# EAGLE schematic 64CharTestDisp (EAGLE 9.4.2)
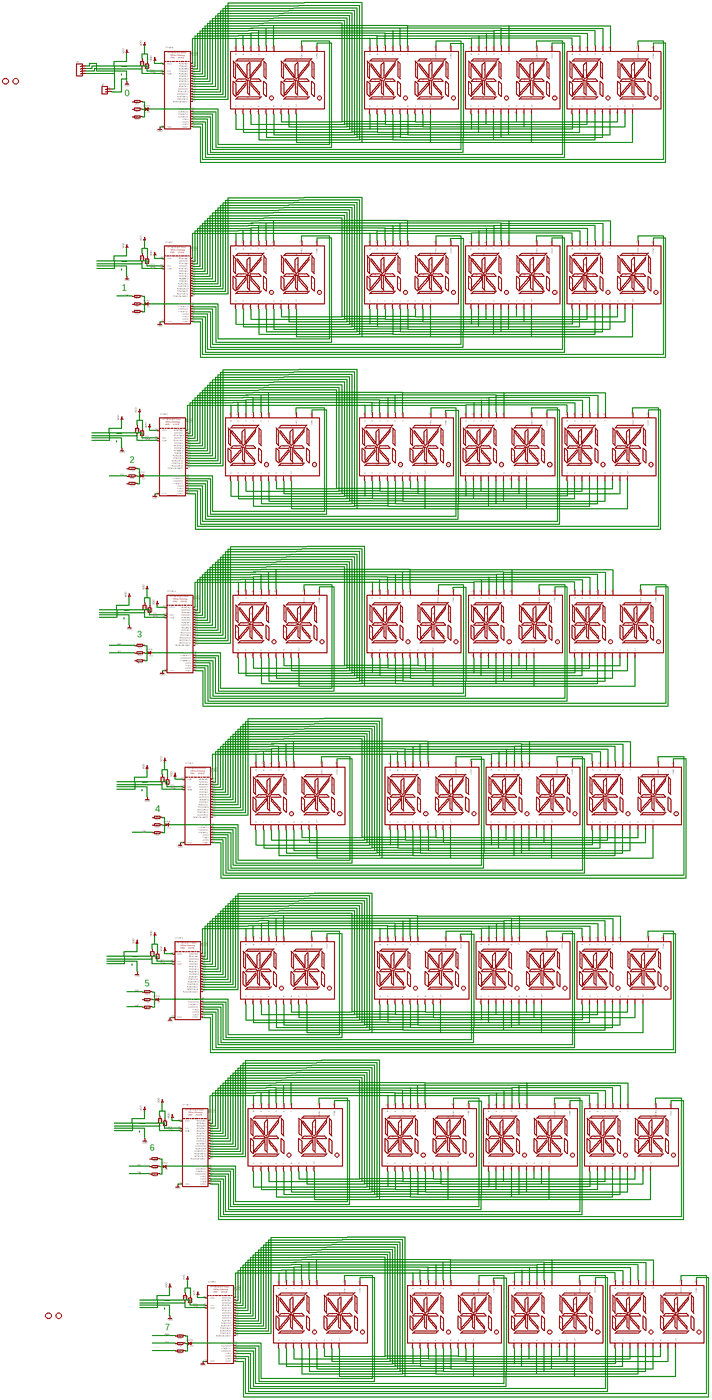
[diagram p0: schematic, sheet 1, overview]
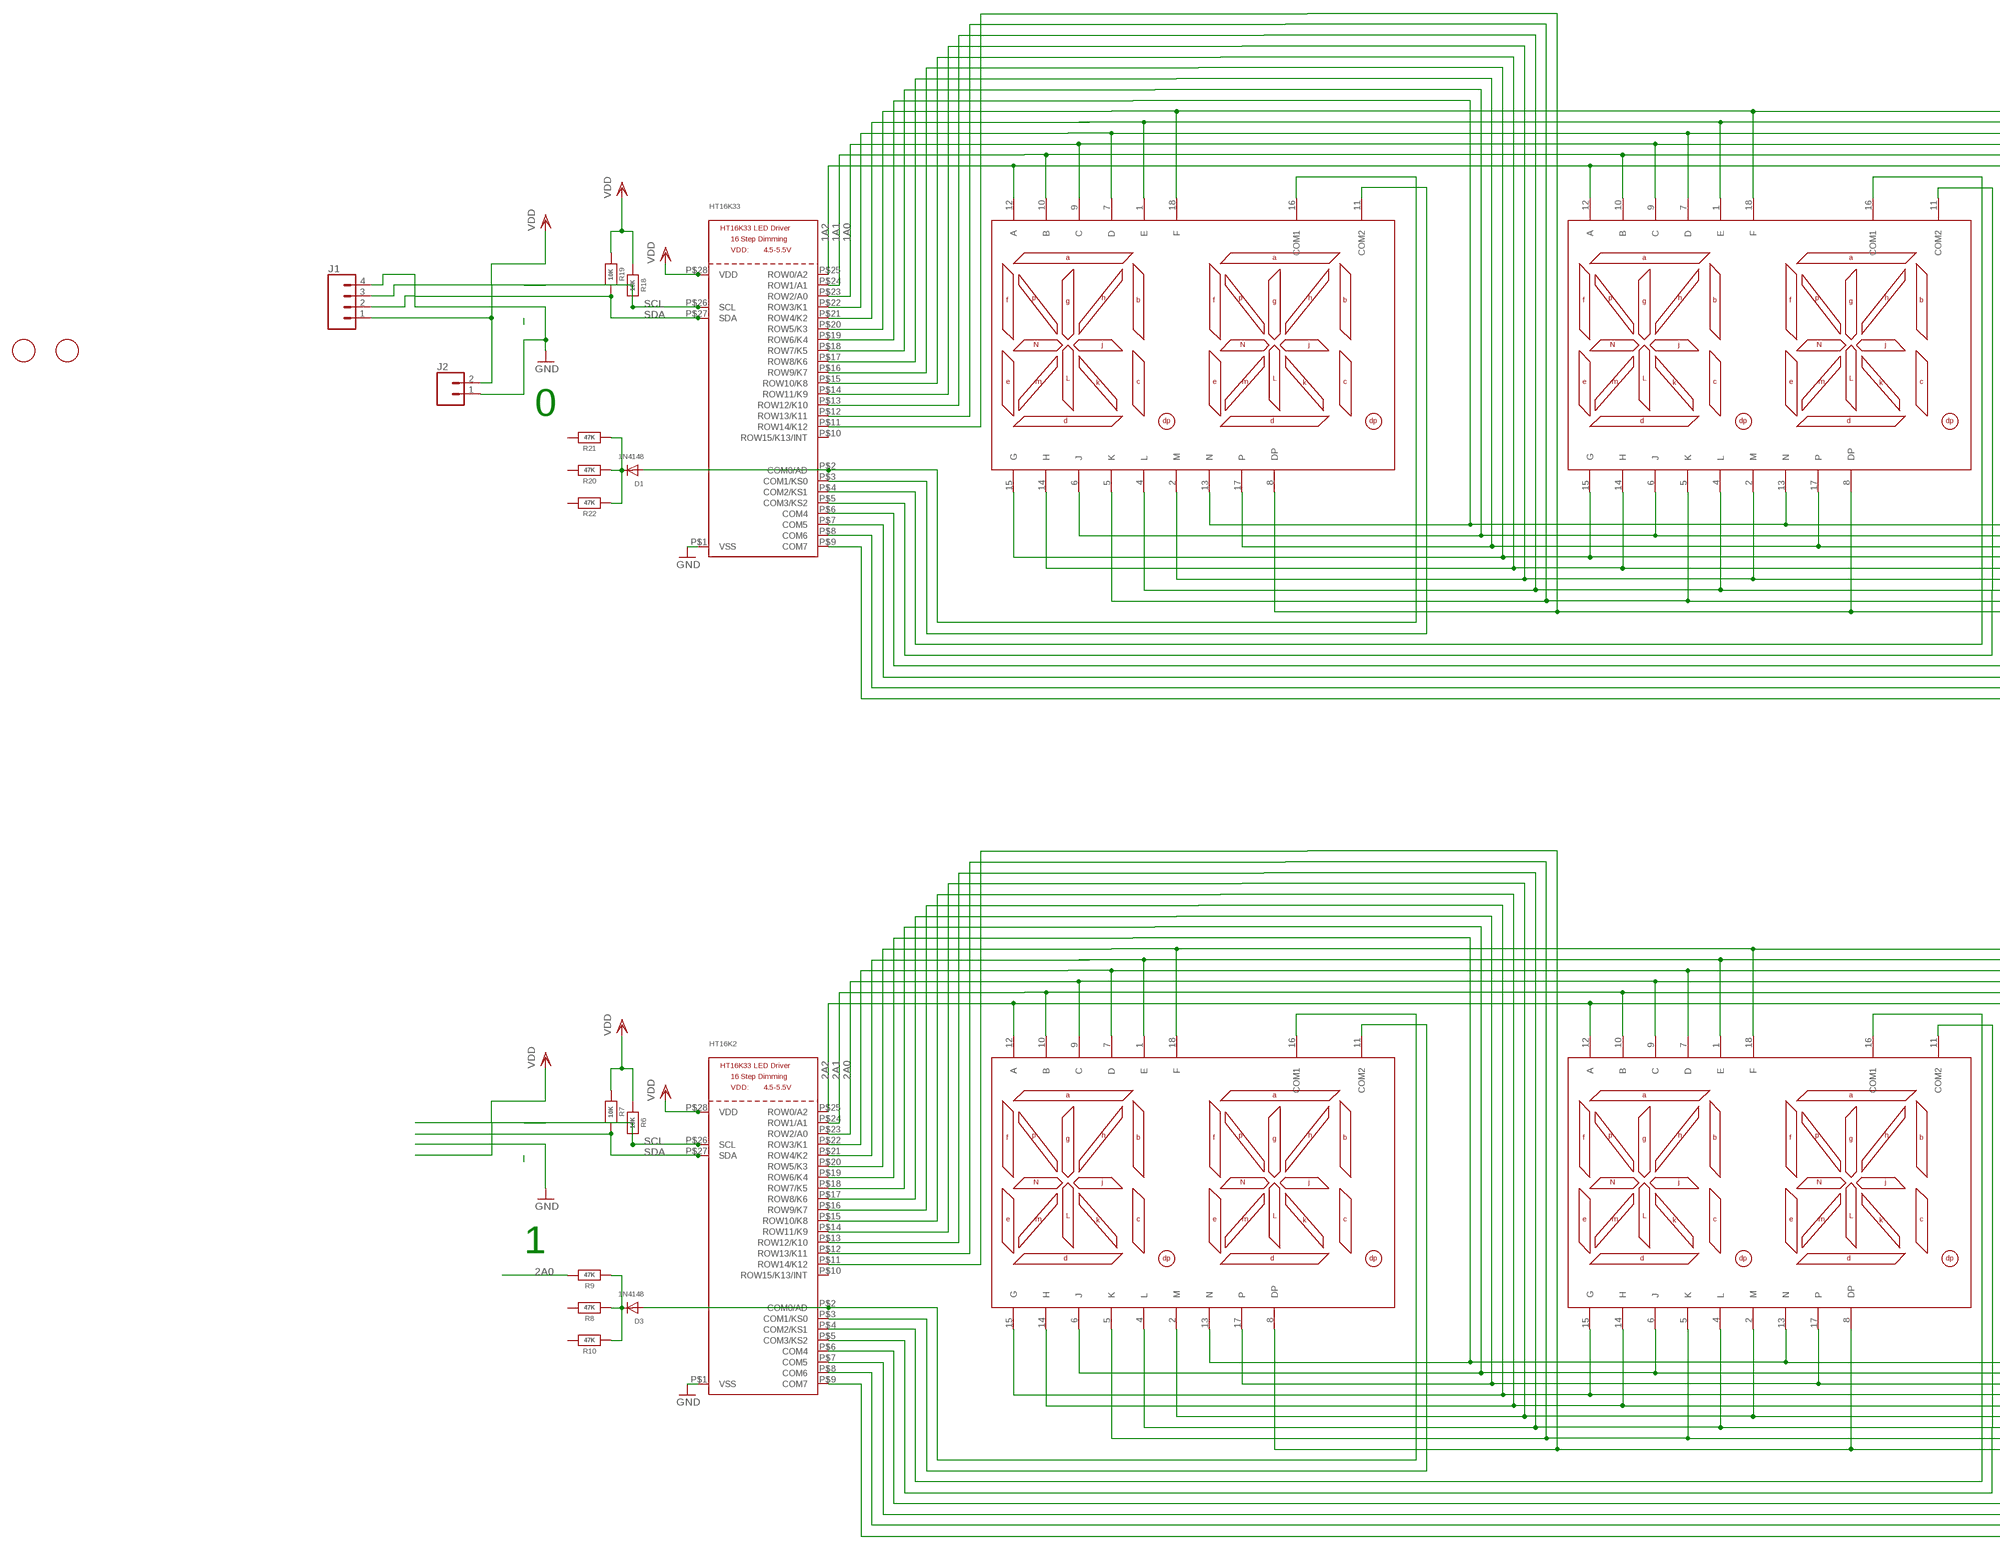
[diagram p1: schematic, sheet 1, part 1 of 8]
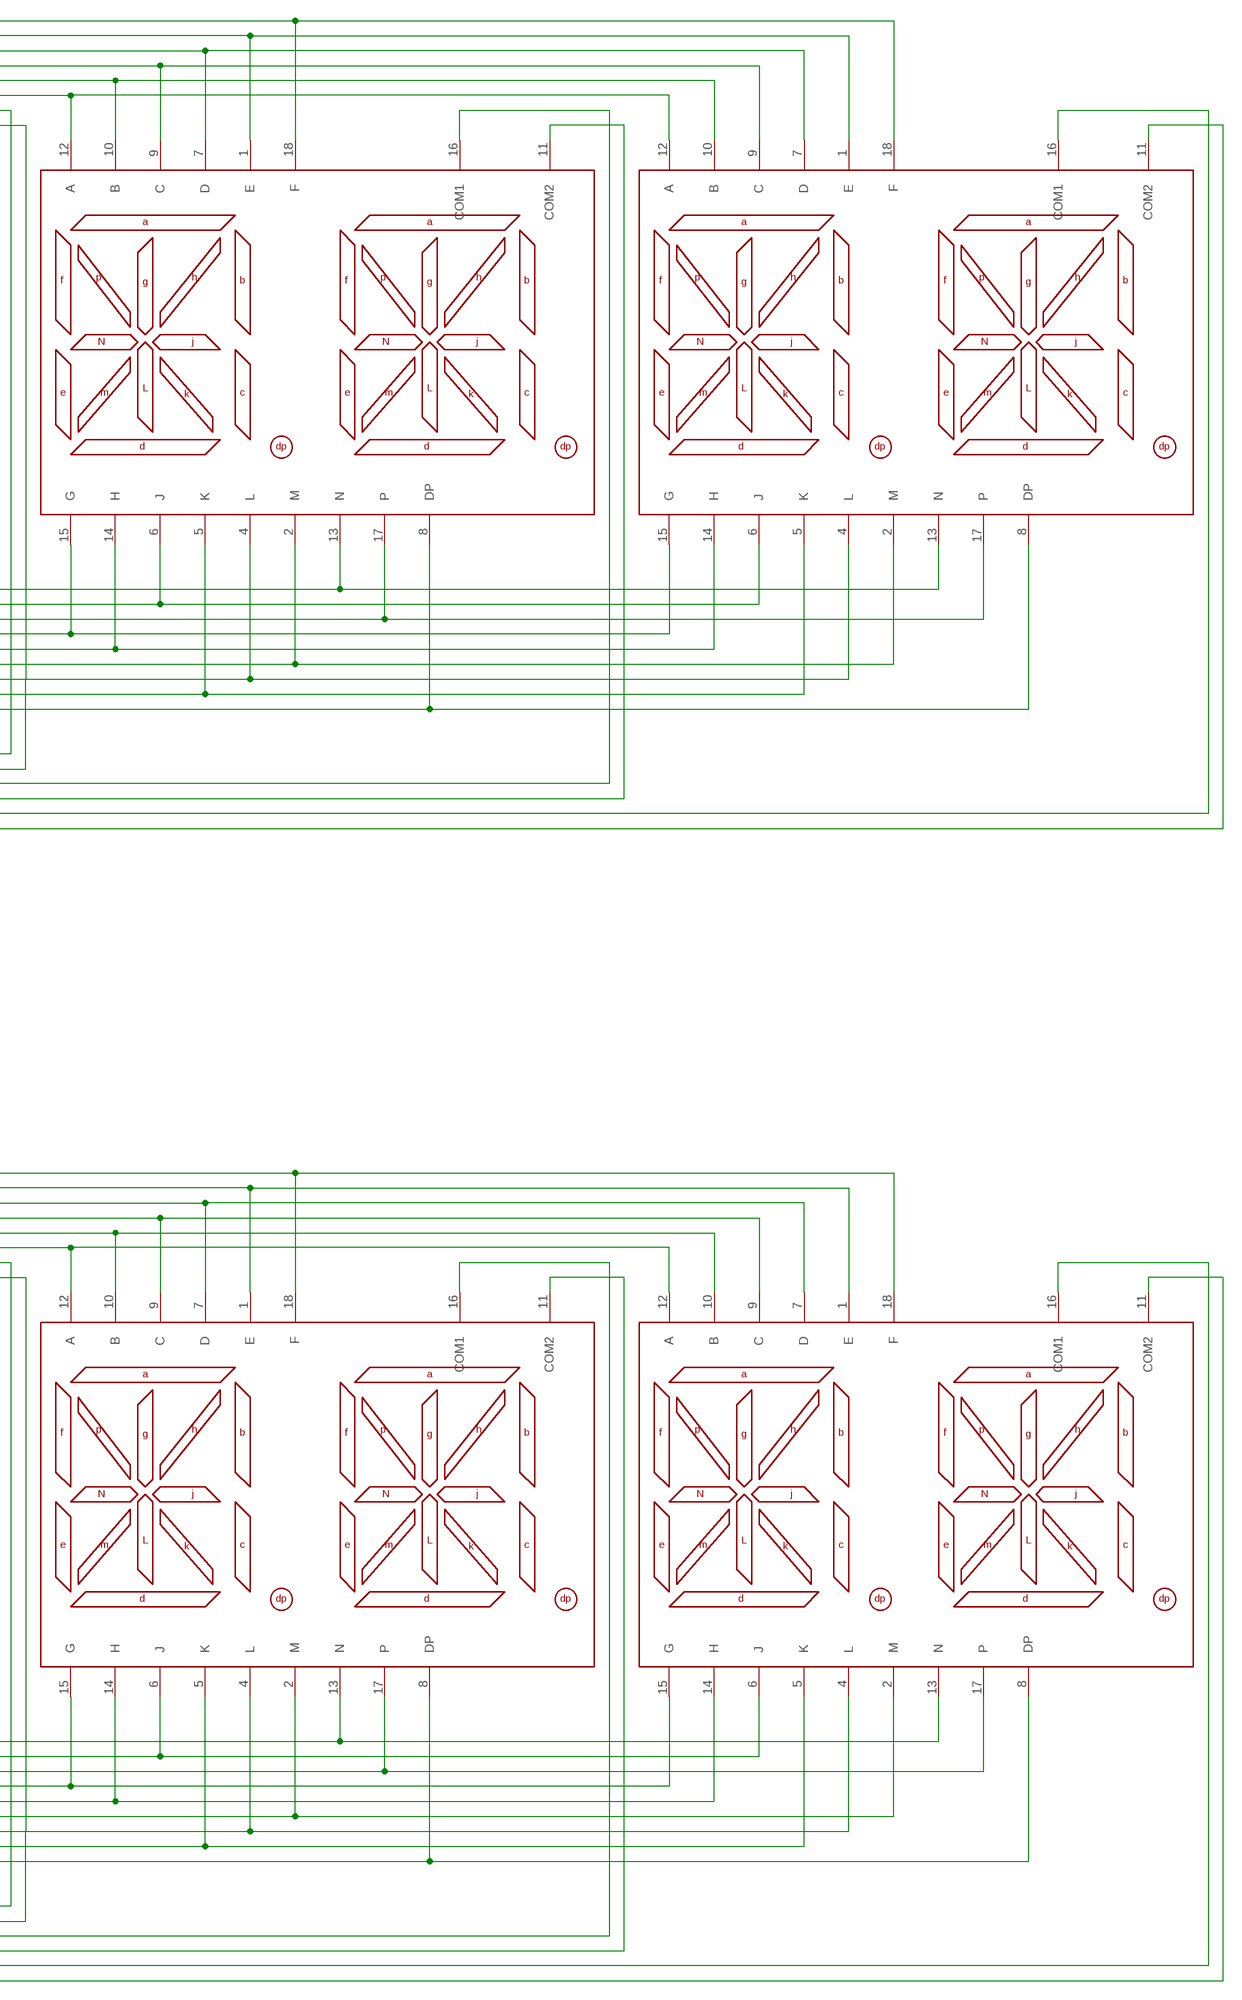
[diagram p2: schematic, sheet 1, part 2 of 8]
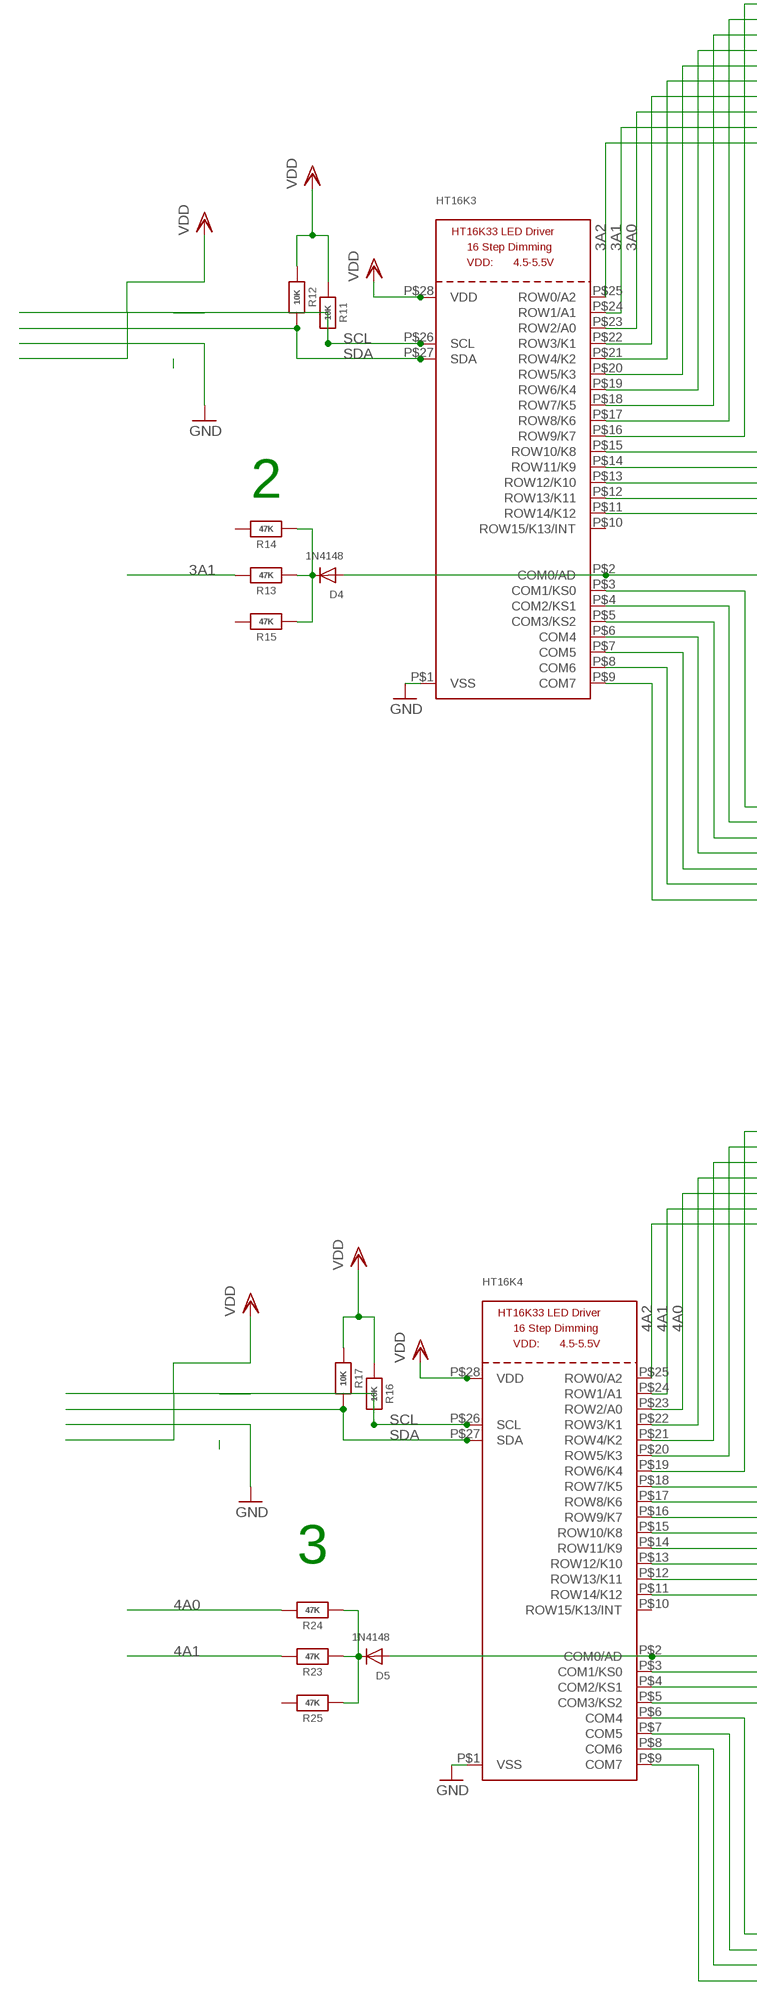
[diagram p3: schematic, sheet 1, part 3 of 8]
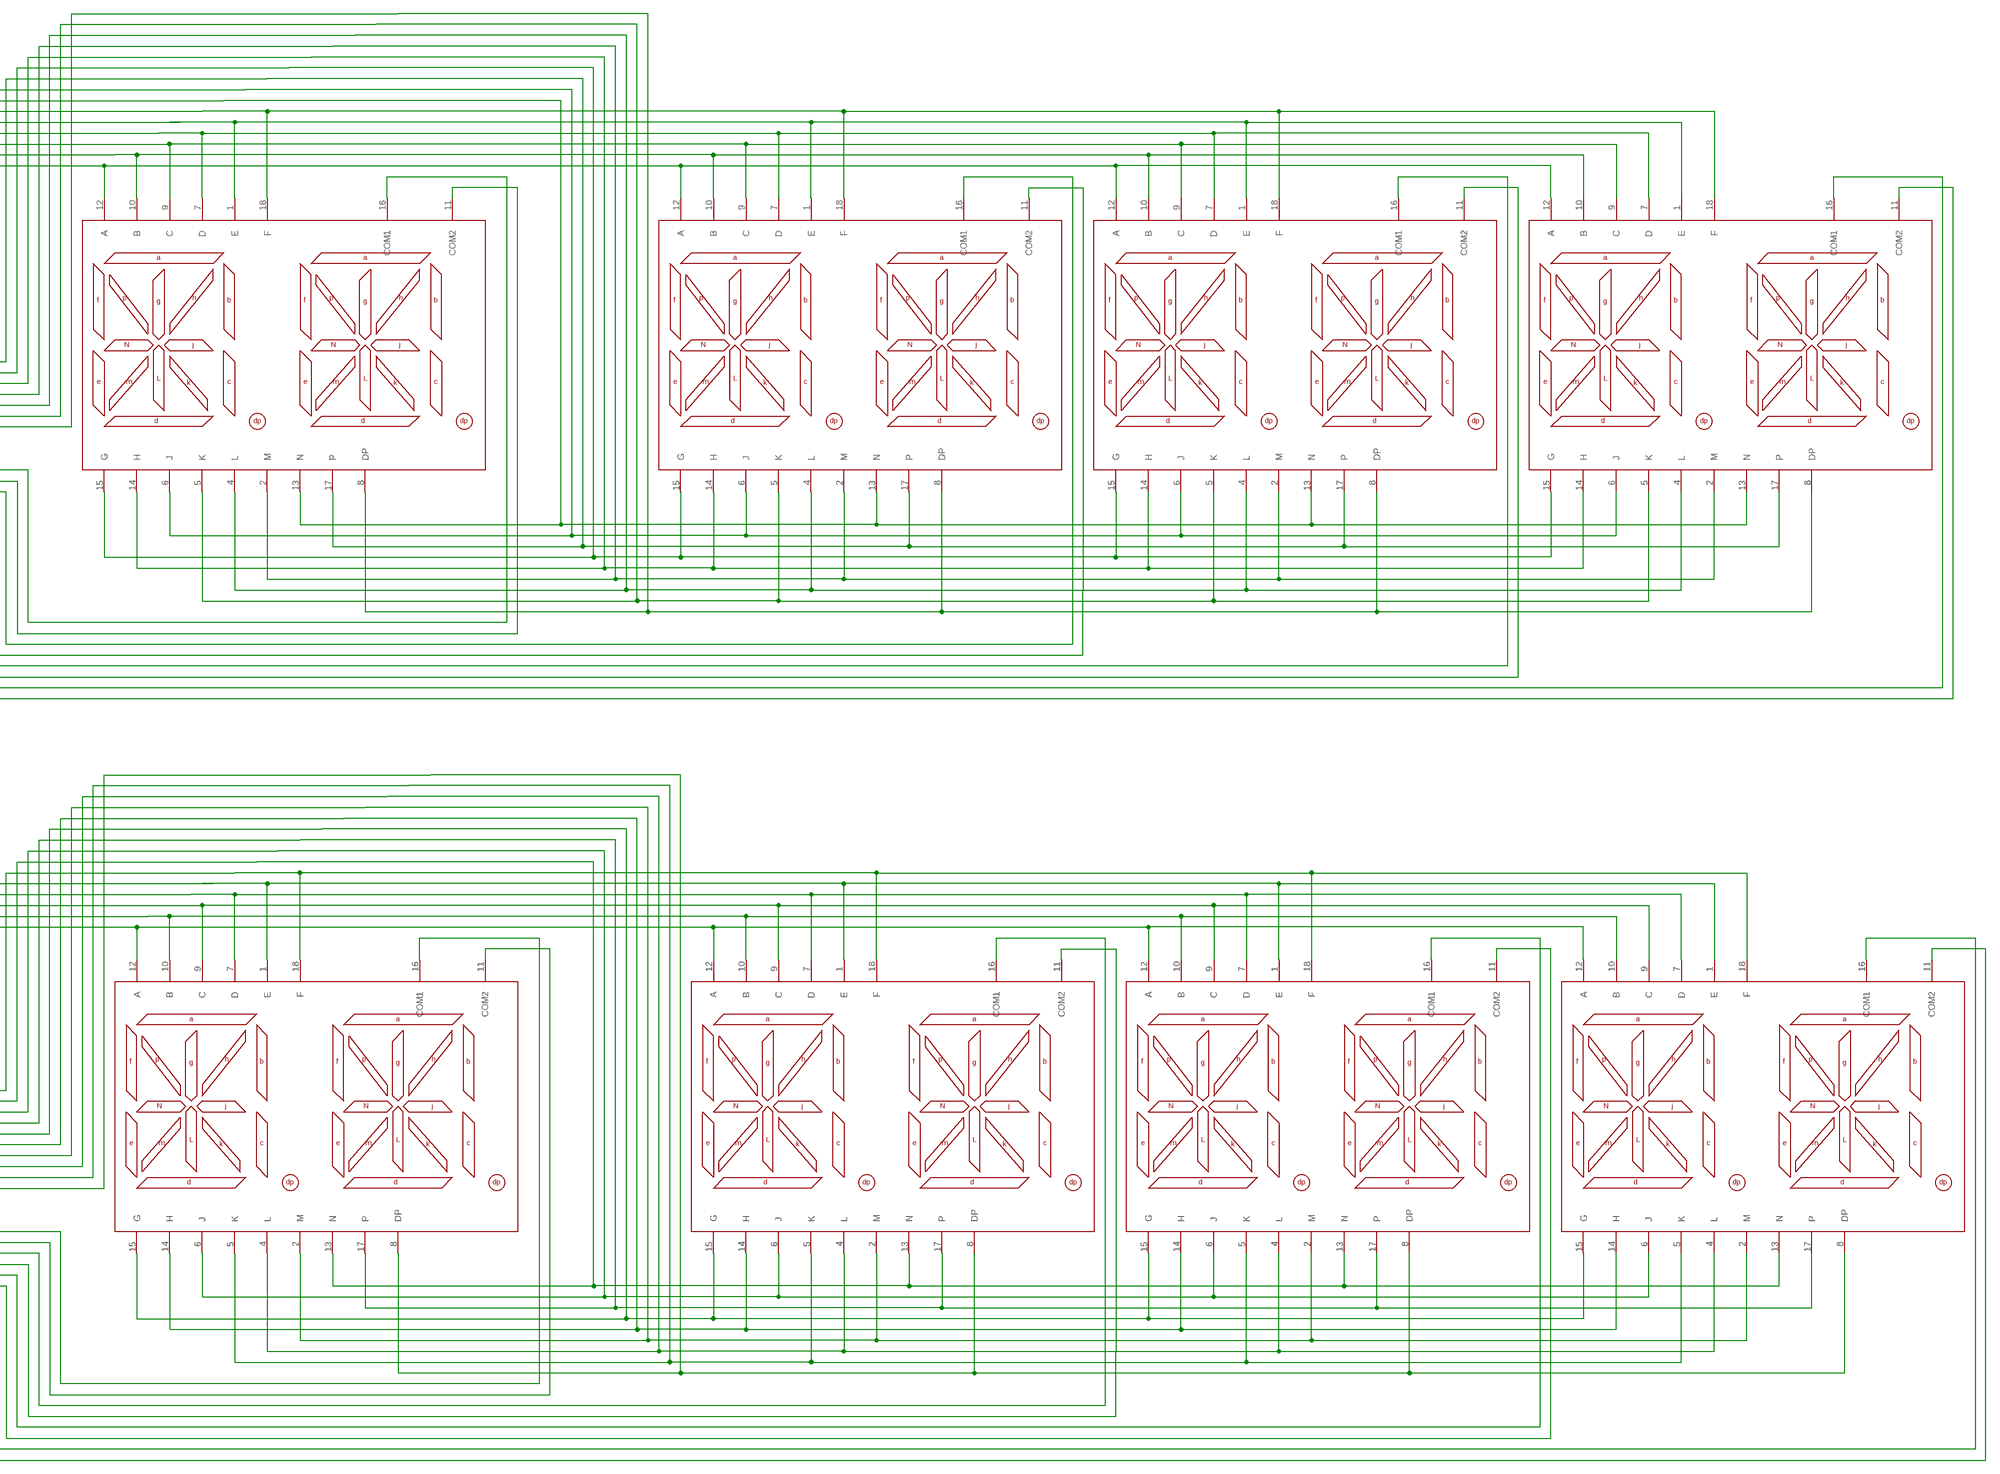
[diagram p4: schematic, sheet 1, part 4 of 8]
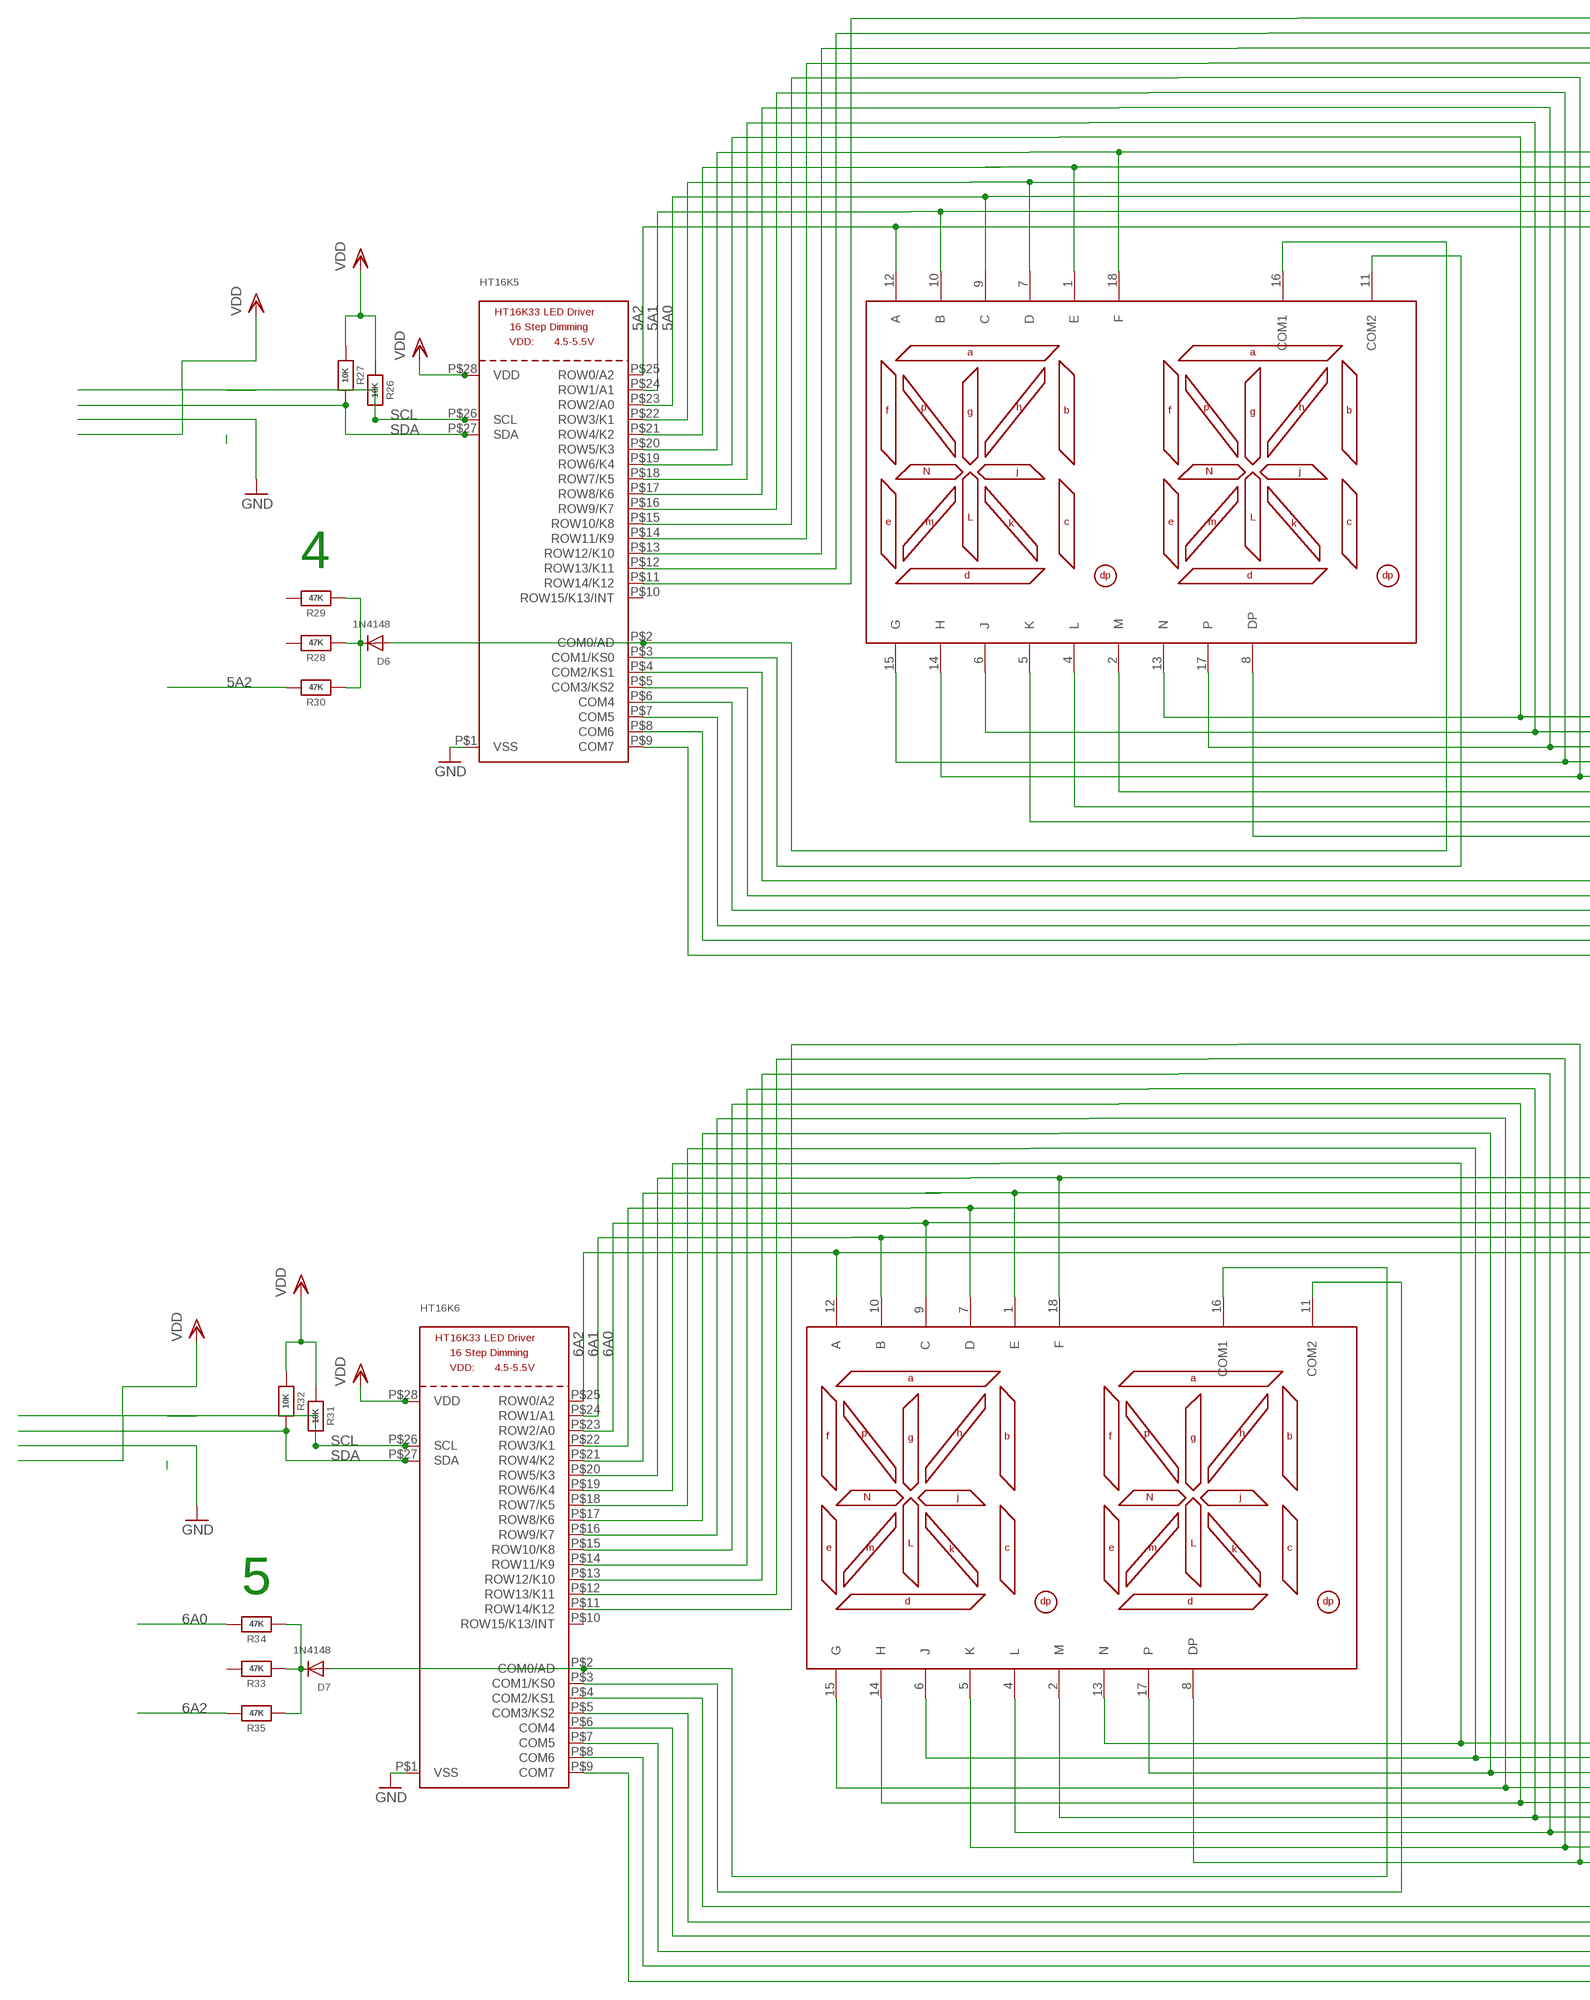
[diagram p5: schematic, sheet 1, part 5 of 8]
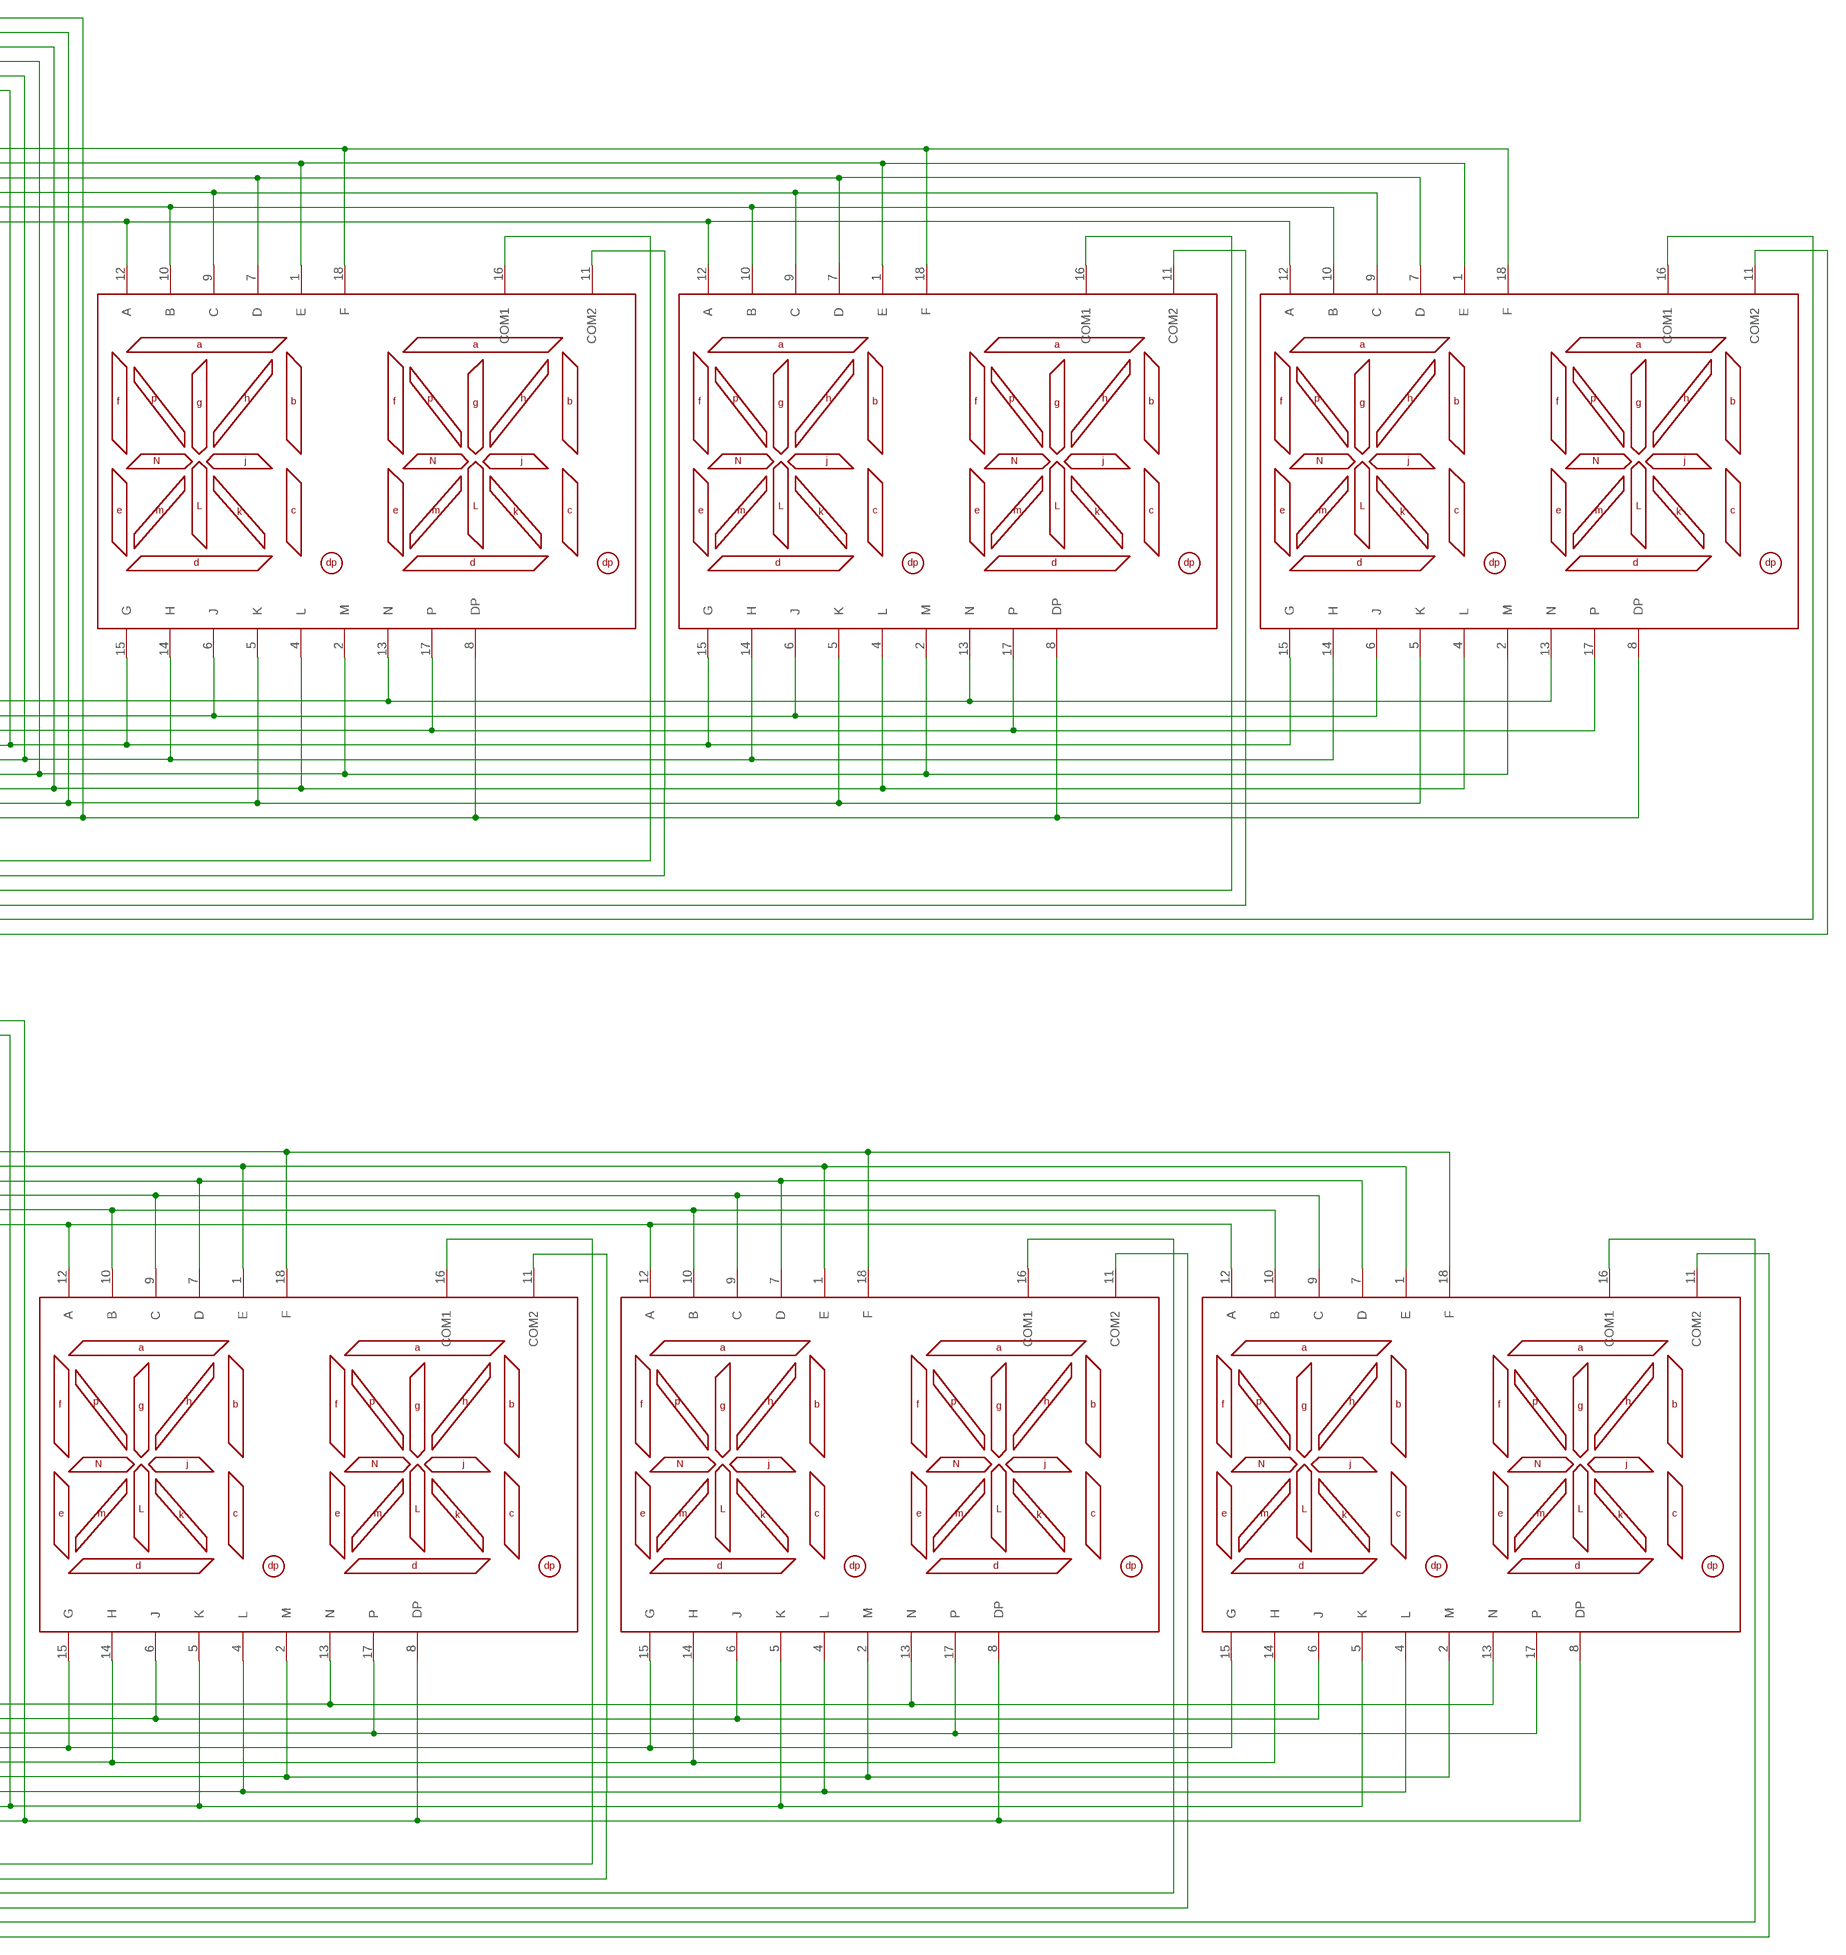
[diagram p6: schematic, sheet 1, part 6 of 8]
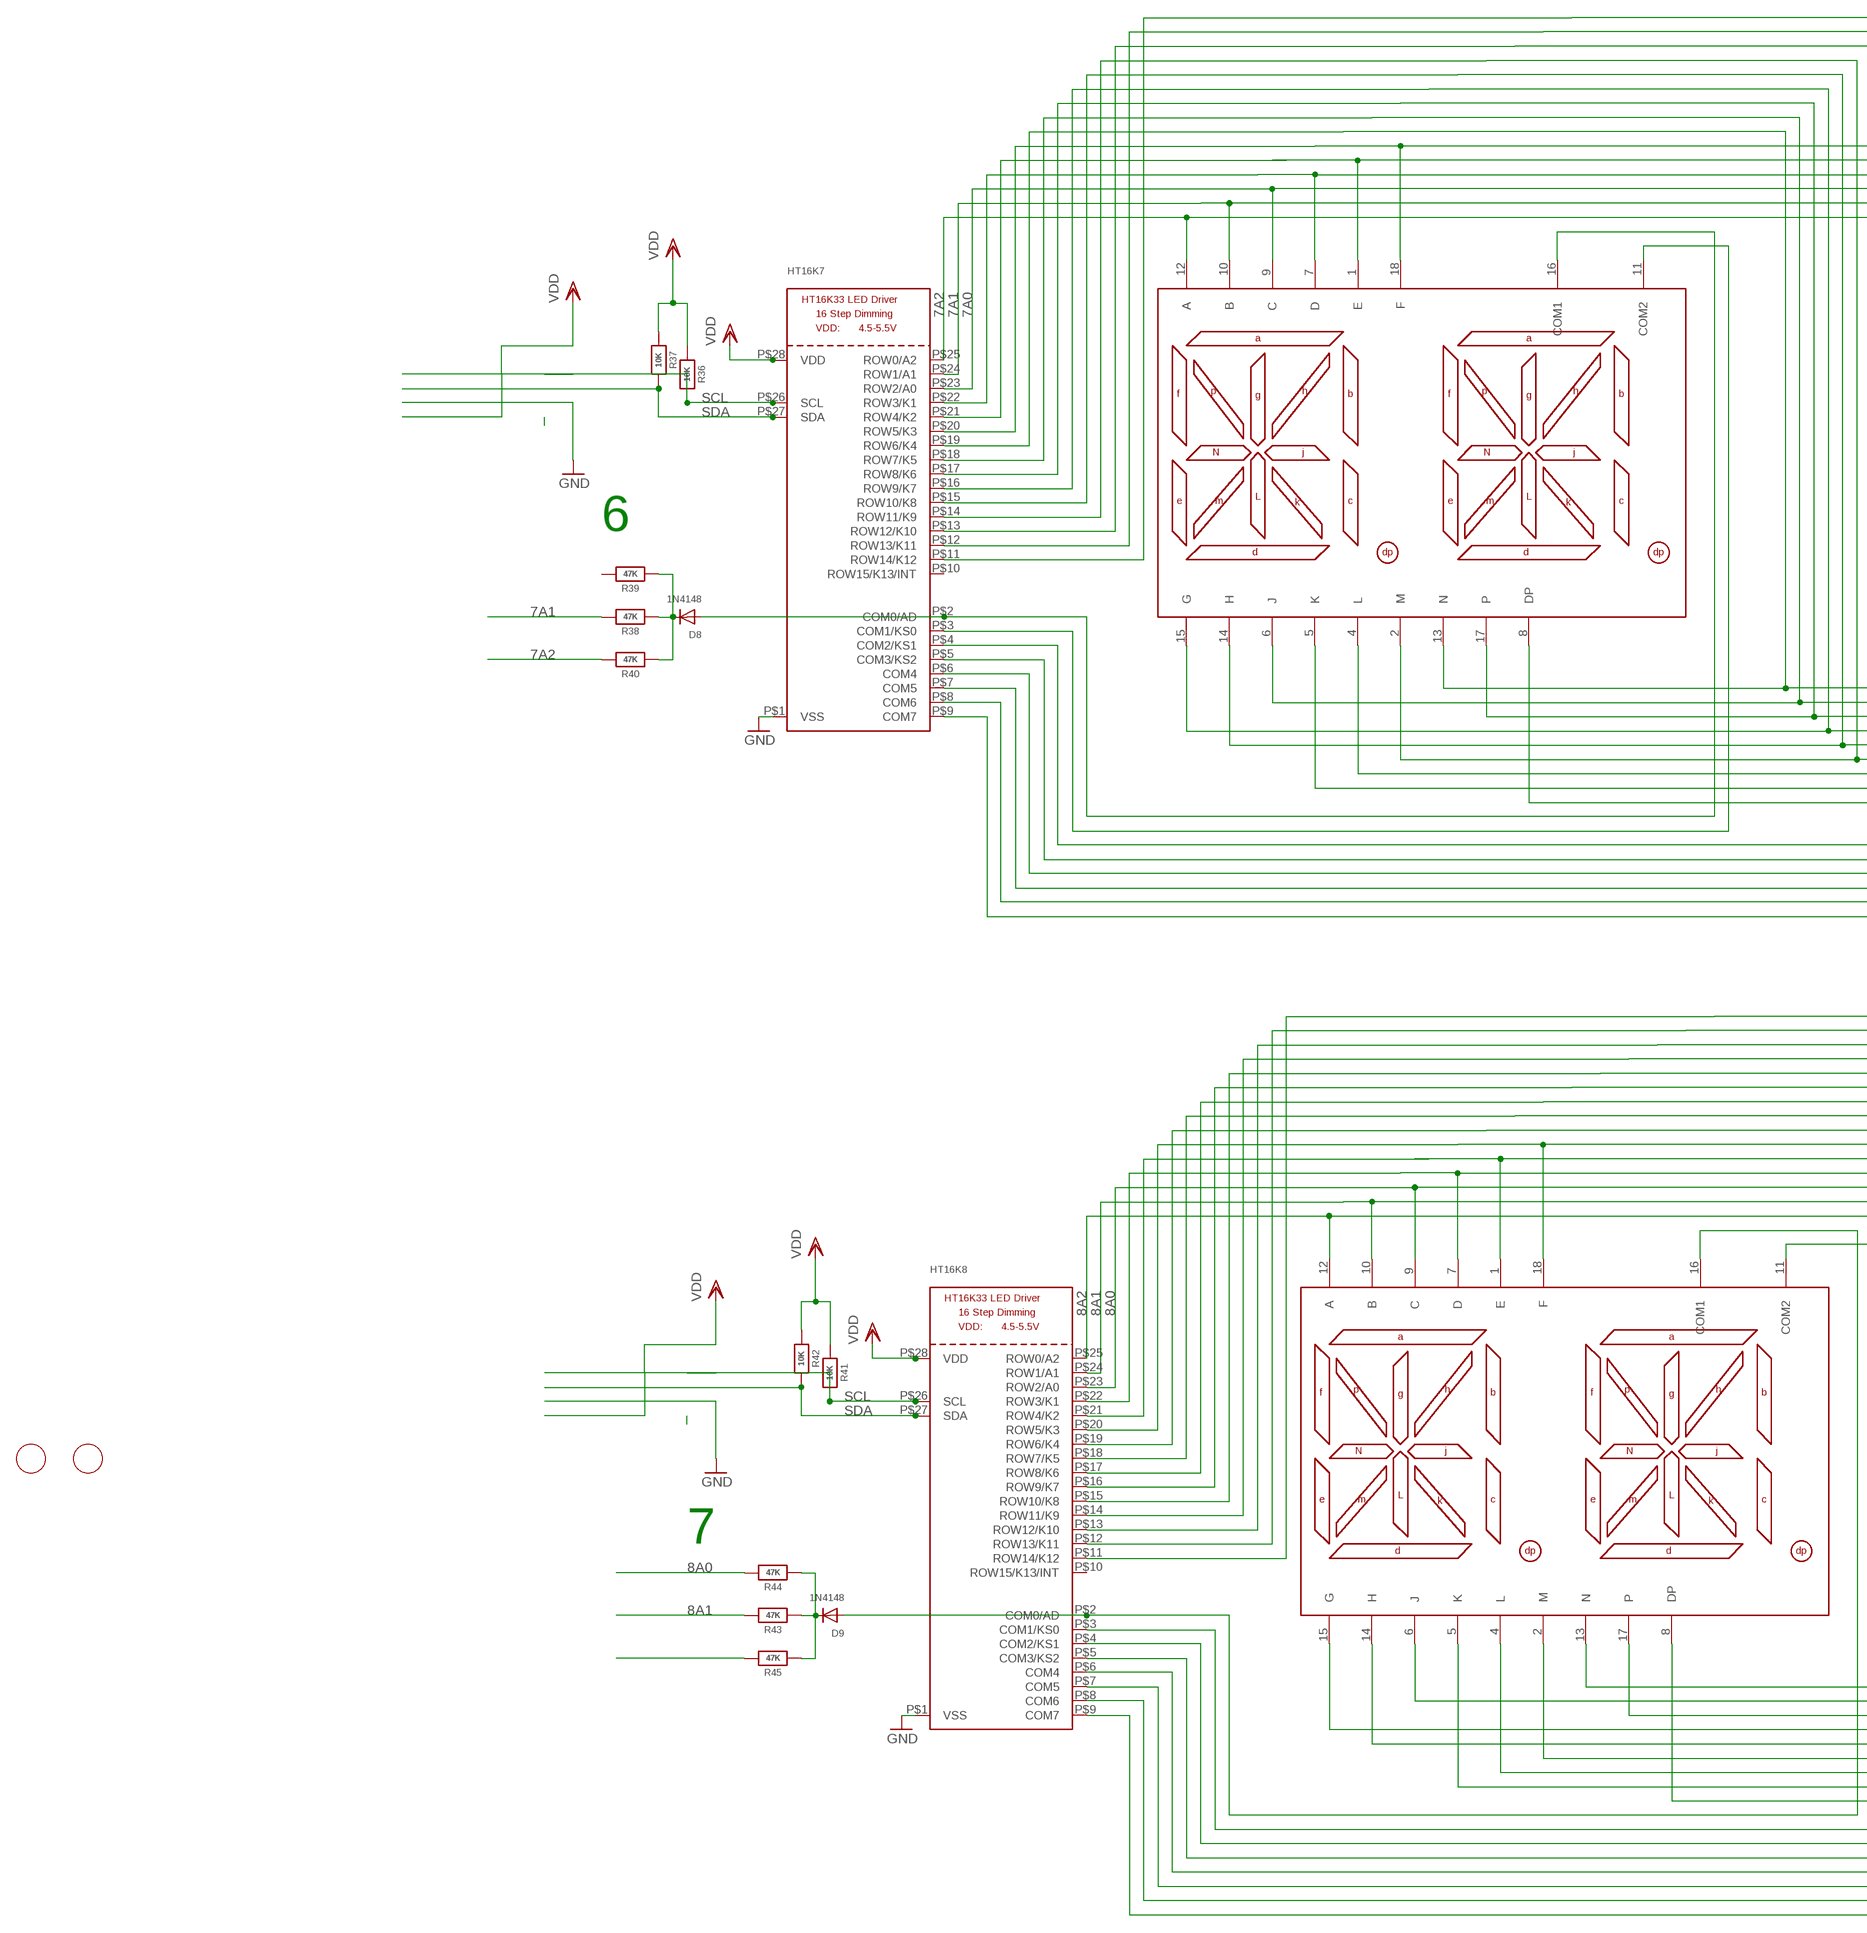
[diagram p7: schematic, sheet 1, part 7 of 8]
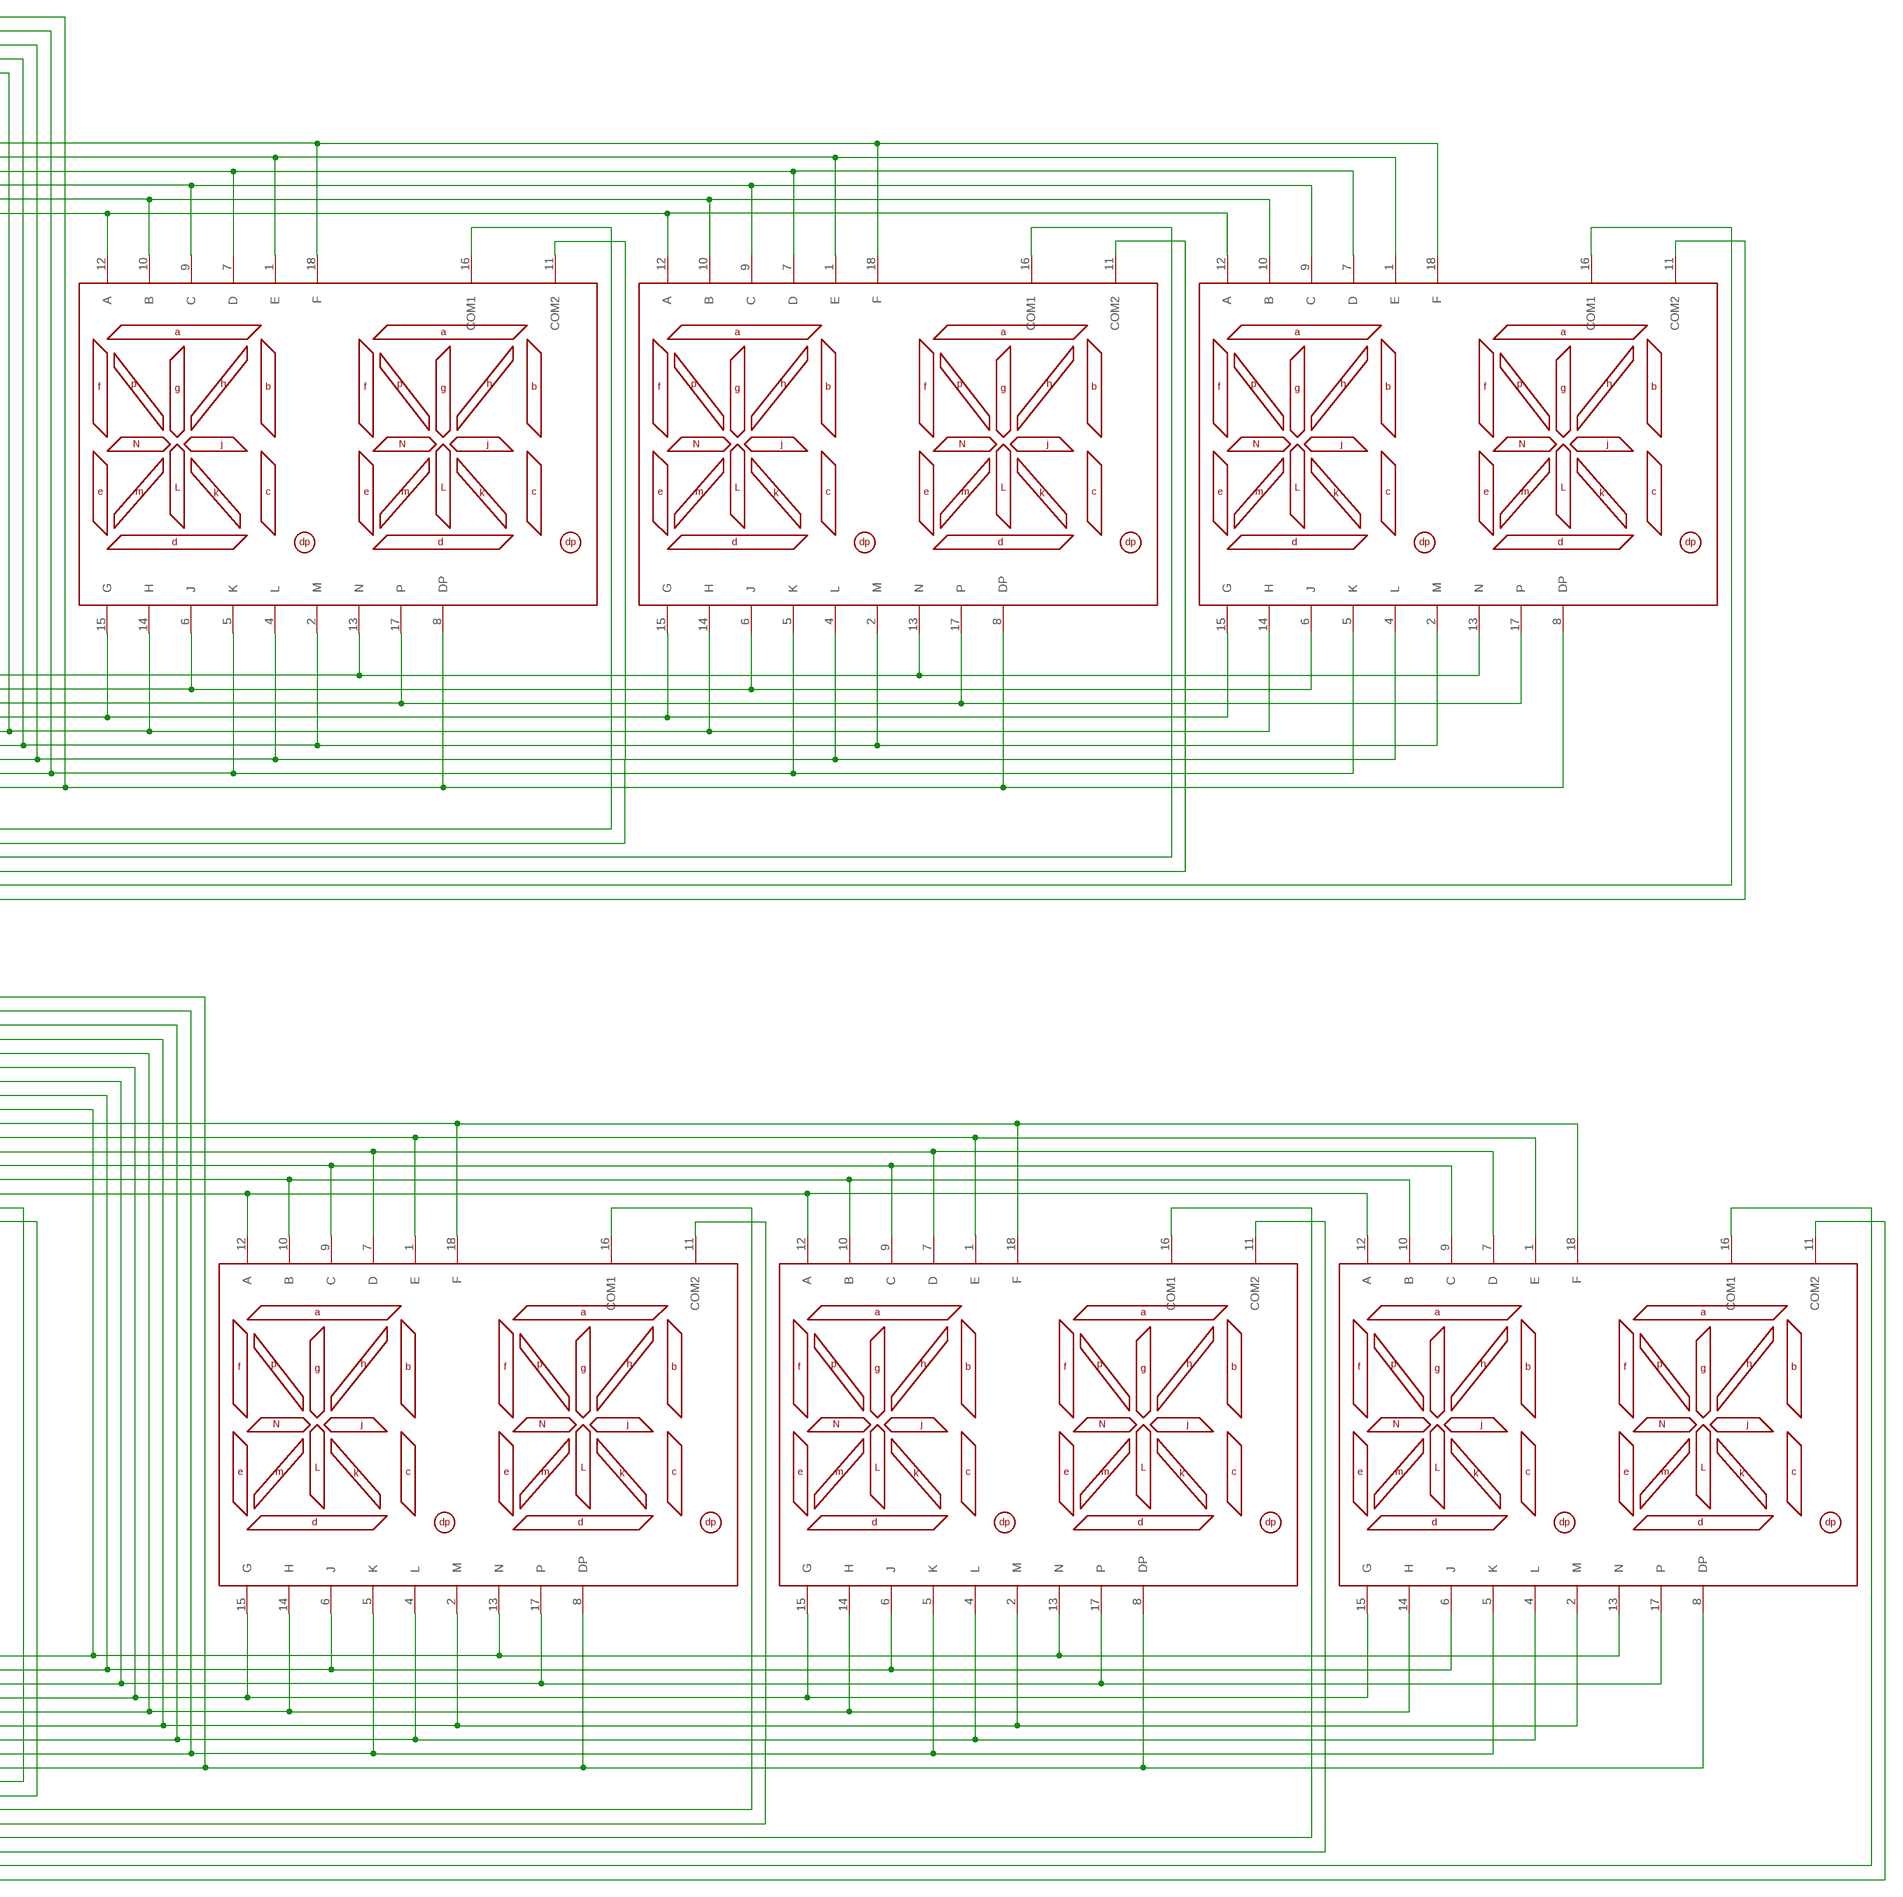
[diagram p8: schematic, sheet 1, part 8 of 8]

## Parts
D1  1N4148  DIODESOD-323F  [SOD-323F]
D3  1N4148  DIODESOD-323F  [SOD-323F]
D4  1N4148  DIODESOD-323F  [SOD-323F]
D5  1N4148  DIODESOD-323F  [SOD-323F]
D6  1N4148  DIODESOD-323F  [SOD-323F]
D7  1N4148  DIODESOD-323F  [SOD-323F]
D8  1N4148  DIODESOD-323F  [SOD-323F]
D9  1N4148  DIODESOD-323F  [SOD-323F]
HT16K2  HT16K33_SOP28_SKINNY  [SOP28_300MIL_SKINNY]
HT16K3  HT16K33_SOP28_SKINNY  [SOP28_300MIL_SKINNY]
HT16K4  HT16K33_SOP28_SKINNY  [SOP28_300MIL_SKINNY]
HT16K5  HT16K33_SOP28_SKINNY  [SOP28_300MIL_SKINNY]
HT16K6  HT16K33_SOP28_SKINNY  [SOP28_300MIL_SKINNY]
HT16K7  HT16K33_SOP28_SKINNY  [SOP28_300MIL_SKINNY]
HT16K8  HT16K33_SOP28_SKINNY  [SOP28_300MIL_SKINNY]
HT16K33  HT16K33_SOP28_SKINNY  [SOP28_300MIL_SKINNY]
J1  CONN_04JST-PTH-VERT  [JST-4-PTH-VERT]
J2  CONN_023.5MM  [SCREWTERMINAL-3.5MM-2]
R6  10K  RESISTOR0805_NOOUTLINE  [0805-NO]
R7  10K  RESISTOR0805_NOOUTLINE  [0805-NO]
R8  47K  RESISTOR0805_NOOUTLINE  [0805-NO]
R9  47K  RESISTOR0805_NOOUTLINE  [0805-NO]
R10  47K  RESISTOR0805_NOOUTLINE  [0805-NO]
R11  10K  RESISTOR0805_NOOUTLINE  [0805-NO]
R12  10K  RESISTOR0805_NOOUTLINE  [0805-NO]
R13  47K  RESISTOR0805_NOOUTLINE  [0805-NO]
R14  47K  RESISTOR0805_NOOUTLINE  [0805-NO]
R15  47K  RESISTOR0805_NOOUTLINE  [0805-NO]
R16  10K  RESISTOR0805_NOOUTLINE  [0805-NO]
R17  10K  RESISTOR0805_NOOUTLINE  [0805-NO]
R18  10K  RESISTOR0805_NOOUTLINE  [0805-NO]
R19  10K  RESISTOR0805_NOOUTLINE  [0805-NO]
R20  47K  RESISTOR0805_NOOUTLINE  [0805-NO]
R21  47K  RESISTOR0805_NOOUTLINE  [0805-NO]
R22  47K  RESISTOR0805_NOOUTLINE  [0805-NO]
R23  47K  RESISTOR0805_NOOUTLINE  [0805-NO]
R24  47K  RESISTOR0805_NOOUTLINE  [0805-NO]
R25  47K  RESISTOR0805_NOOUTLINE  [0805-NO]
R26  10K  RESISTOR0805_NOOUTLINE  [0805-NO]
R27  10K  RESISTOR0805_NOOUTLINE  [0805-NO]
R28  47K  RESISTOR0805_NOOUTLINE  [0805-NO]
R29  47K  RESISTOR0805_NOOUTLINE  [0805-NO]
R30  47K  RESISTOR0805_NOOUTLINE  [0805-NO]
R31  10K  RESISTOR0805_NOOUTLINE  [0805-NO]
R32  10K  RESISTOR0805_NOOUTLINE  [0805-NO]
R33  47K  RESISTOR0805_NOOUTLINE  [0805-NO]
R34  47K  RESISTOR0805_NOOUTLINE  [0805-NO]
R35  47K  RESISTOR0805_NOOUTLINE  [0805-NO]
R36  10K  RESISTOR0805_NOOUTLINE  [0805-NO]
R37  10K  RESISTOR0805_NOOUTLINE  [0805-NO]
R38  47K  RESISTOR0805_NOOUTLINE  [0805-NO]
R39  47K  RESISTOR0805_NOOUTLINE  [0805-NO]
R40  47K  RESISTOR0805_NOOUTLINE  [0805-NO]
R41  10K  RESISTOR0805_NOOUTLINE  [0805-NO]
R42  10K  RESISTOR0805_NOOUTLINE  [0805-NO]
R43  47K  RESISTOR0805_NOOUTLINE  [0805-NO]
R44  47K  RESISTOR0805_NOOUTLINE  [0805-NO]
R45  47K  RESISTOR0805_NOOUTLINE  [0805-NO]
U$2  BIG14SEG  [HDSP]
U$3  BIG14SEG  [HDSP]
U$4  BIG14SEG  [HDSP]
U$5  BIG14SEG  [HDSP]
U$11  BIG14SEG  [HDSP]
U$12  BIG14SEG  [HDSP]
U$13  BIG14SEG  [HDSP]
U$14  BIG14SEG  [HDSP]
U$15  BIG14SEG  [HDSP]
U$16  BIG14SEG  [HDSP]
U$17  BIG14SEG  [HDSP]
U$18  BIG14SEG  [HDSP]
U$19  BIG14SEG  [HDSP]
U$20  BIG14SEG  [HDSP]
U$21  BIG14SEG  [HDSP]
U$22  BIG14SEG  [HDSP]
U$23  BIG14SEG  [HDSP]
U$24  BIG14SEG  [HDSP]
U$25  BIG14SEG  [HDSP]
U$26  BIG14SEG  [HDSP]
U$27  BIG14SEG  [HDSP]
U$28  BIG14SEG  [HDSP]
U$29  BIG14SEG  [HDSP]
U$30  BIG14SEG  [HDSP]
U$31  BIG14SEG  [HDSP]
U$32  BIG14SEG  [HDSP]
U$33  BIG14SEG  [HDSP]
U$34  BIG14SEG  [HDSP]
U$35  KEYSTONESTANDOFF  [KEYSTONESTANDOFF]
U$36  KEYSTONESTANDOFF  [KEYSTONESTANDOFF]
U$37  BIG14SEG  [HDSP]
U$38  BIG14SEG  [HDSP]
U$39  BIG14SEG  [HDSP]
U$40  BIG14SEG  [HDSP]
U$41  KEYSTONESTANDOFF  [KEYSTONESTANDOFF]
U$42  KEYSTONESTANDOFF  [KEYSTONESTANDOFF]

## Nets
1A0: HT16K33.P$23(ROW2/A0) U$2.9(C) U$3.9(C) U$4.9(C) U$5.9(C)
1A1: HT16K33.P$24(ROW1/A1) U$2.10(B) U$3.10(B) U$4.10(B) U$5.10(B)
1A2: HT16K33.P$25(ROW0/A2) U$2.12(A) U$3.12(A) U$4.12(A) U$5.12(A)
2A0: HT16K2.P$23(ROW2/A0) R9.2 U$11.9(C) U$12.9(C) U$13.9(C) U$14.9(C)
2A1: HT16K2.P$24(ROW1/A1) U$11.10(B) U$12.10(B) U$13.10(B) U$14.10(B)
2A2: HT16K2.P$25(ROW0/A2) U$11.12(A) U$12.12(A) U$13.12(A) U$14.12(A)
3A0: HT16K3.P$23(ROW2/A0) U$15.9(C) U$16.9(C) U$17.9(C) U$18.9(C)
3A1: HT16K3.P$24(ROW1/A1) R13.2 U$15.10(B) U$16.10(B) U$17.10(B) U$18.10(B)
3A2: HT16K3.P$25(ROW0/A2) U$15.12(A) U$16.12(A) U$17.12(A) U$18.12(A)
4A0: HT16K4.P$23(ROW2/A0) R24.2 U$19.9(C) U$20.9(C) U$21.9(C) U$22.9(C)
4A1: HT16K4.P$24(ROW1/A1) R23.2 U$19.10(B) U$20.10(B) U$21.10(B) U$22.10(B)
4A2: HT16K4.P$25(ROW0/A2) U$19.12(A) U$20.12(A) U$21.12(A) U$22.12(A)
5A0: HT16K5.P$23(ROW2/A0) U$23.9(C) U$24.9(C) U$25.9(C) U$26.9(C)
5A1: HT16K5.P$24(ROW1/A1) U$23.10(B) U$24.10(B) U$25.10(B) U$26.10(B)
5A2: HT16K5.P$25(ROW0/A2) R30.2 U$23.12(A) U$24.12(A) U$25.12(A) U$26.12(A)
6A0: HT16K6.P$23(ROW2/A0) R34.2 U$27.9(C) U$28.9(C) U$29.9(C) U$30.9(C)
6A1: HT16K6.P$24(ROW1/A1) U$27.10(B) U$28.10(B) U$29.10(B) U$30.10(B)
6A2: HT16K6.P$25(ROW0/A2) R35.2 U$27.12(A) U$28.12(A) U$29.12(A) U$30.12(A)
7A0: HT16K7.P$23(ROW2/A0) U$31.9(C) U$32.9(C) U$33.9(C) U$34.9(C)
7A1: HT16K7.P$24(ROW1/A1) R38.2 U$31.10(B) U$32.10(B) U$33.10(B) U$34.10(B)
7A2: HT16K7.P$25(ROW0/A2) R40.2 U$31.12(A) U$32.12(A) U$33.12(A) U$34.12(A)
8A0: HT16K8.P$23(ROW2/A0) R44.2 U$37.9(C) U$38.9(C) U$39.9(C) U$40.9(C)
8A1: HT16K8.P$24(ROW1/A1) R43.2 U$37.10(B) U$38.10(B) U$39.10(B) U$40.10(B)
8A2: HT16K8.P$25(ROW0/A2) R45.2 U$37.12(A) U$38.12(A) U$39.12(A) U$40.12(A)
GND: HT16K2.P$1(VSS) HT16K3.P$1(VSS) HT16K4.P$1(VSS) HT16K5.P$1(VSS) HT16K6.P$1(VSS) HT16K7.P$1(VSS) HT16K8.P$1(VSS) HT16K33.P$1(VSS) J1.4 J2.1
N$1: D1.A HT16K33.P$2(COM0/AD) U$2.16(COM1)
N$2: D3.A HT16K2.P$2(COM0/AD) U$11.16(COM1)
N$3: HT16K33.P$22(ROW3/K1) U$2.7(D) U$3.7(D) U$4.7(D) U$5.7(D)
N$4: HT16K33.P$21(ROW4/K2) U$2.1(E) U$3.1(E) U$4.1(E) U$5.1(E)
N$5: HT16K33.P$20(ROW5/K3) U$2.18(F) U$3.18(F) U$4.18(F) U$5.18(F)
N$6: HT16K33.P$19(ROW6/K4) U$2.13(N) U$3.13(N) U$4.13(N) U$5.13(N)
N$7: HT16K33.P$18(ROW7/K5) U$2.6(J) U$3.6(J) U$4.6(J) U$5.6(J)
N$8: D1.C R20.1 R21.1 R22.1
N$9: D4.A HT16K3.P$2(COM0/AD) U$15.16(COM1)
N$10: HT16K33.P$17(ROW8/K6) U$2.17(P) U$3.17(P) U$4.17(P) U$5.17(P)
N$11: HT16K33.P$16(ROW9/K7) U$2.15(G) U$3.15(G) U$4.15(G) U$5.15(G)
N$12: HT16K33.P$15(ROW10/K8) U$2.14(H) U$3.14(H) U$4.14(H) U$5.14(H)
N$16: HT16K33.P$4(COM2/KS1) U$3.16(COM1)
N$17: HT16K33.P$8(COM6) U$5.16(COM1)
N$18: HT16K33.P$5(COM3/KS2) U$3.11(COM2)
N$19: HT16K33.P$6(COM4) U$4.16(COM1)
N$20: HT16K33.P$7(COM5) U$4.11(COM2)
N$21: HT16K33.P$9(COM7) U$5.11(COM2)
N$22: D5.A HT16K4.P$2(COM0/AD) U$19.16(COM1)
N$23: D6.A HT16K5.P$2(COM0/AD) U$23.16(COM1)
N$24: D7.A HT16K6.P$2(COM0/AD) U$27.16(COM1)
N$25: D8.A HT16K7.P$2(COM0/AD) U$31.16(COM1)
N$26: D9.A HT16K8.P$2(COM0/AD) U$37.16(COM1)
N$32: HT16K33.P$14(ROW11/K9) U$2.2(M) U$3.2(M) U$4.2(M) U$5.2(M)
N$33: HT16K33.P$13(ROW12/K10) U$2.4(L) U$3.4(L) U$4.4(L) U$5.4(L)
N$34: HT16K33.P$12(ROW13/K11) U$2.5(K) U$3.5(K) U$4.5(K) U$5.5(K)
N$35: HT16K33.P$11(ROW14/K12) U$2.8(DP) U$3.8(DP) U$4.8(DP) U$5.8(DP)
N$54: HT16K2.P$22(ROW3/K1) U$11.7(D) U$12.7(D) U$13.7(D) U$14.7(D)
N$55: HT16K2.P$21(ROW4/K2) U$11.1(E) U$12.1(E) U$13.1(E) U$14.1(E)
N$56: HT16K2.P$20(ROW5/K3) U$11.18(F) U$12.18(F) U$13.18(F) U$14.18(F)
N$57: HT16K2.P$19(ROW6/K4) U$11.13(N) U$12.13(N) U$13.13(N) U$14.13(N)
N$58: HT16K2.P$18(ROW7/K5) U$11.6(J) U$12.6(J) U$13.6(J) U$14.6(J)
N$59: D3.C R8.1 R9.1 R10.1
N$61: HT16K2.P$17(ROW8/K6) U$11.17(P) U$12.17(P) U$13.17(P) U$14.17(P)
N$62: HT16K2.P$16(ROW9/K7) U$11.15(G) U$12.15(G) U$13.15(G) U$14.15(G)
N$63: HT16K2.P$15(ROW10/K8) U$11.14(H) U$12.14(H) U$13.14(H) U$14.14(H)
N$64: HT16K2.P$14(ROW11/K9) U$11.2(M) U$12.2(M) U$13.2(M) U$14.2(M)
N$65: HT16K2.P$13(ROW12/K10) U$11.4(L) U$12.4(L) U$13.4(L) U$14.4(L)
N$66: HT16K2.P$12(ROW13/K11) U$11.5(K) U$12.5(K) U$13.5(K) U$14.5(K)
N$67: HT16K2.P$11(ROW14/K12) U$11.8(DP) U$12.8(DP) U$13.8(DP) U$14.8(DP)
N$71: HT16K2.P$5(COM3/KS2) U$12.11(COM2)
N$72: HT16K2.P$4(COM2/KS1) U$12.16(COM1)
N$73: HT16K2.P$6(COM4) U$13.16(COM1)
N$74: HT16K2.P$7(COM5) U$13.11(COM2)
N$75: HT16K2.P$8(COM6) U$14.16(COM1)
N$76: HT16K2.P$9(COM7) U$14.11(COM2)
N$77: HT16K2.P$3(COM1/KS0) U$11.11(COM2)
N$80: HT16K3.P$22(ROW3/K1) U$15.7(D) U$16.7(D) U$17.7(D) U$18.7(D)
N$81: HT16K3.P$21(ROW4/K2) U$15.1(E) U$16.1(E) U$17.1(E) U$18.1(E)
N$82: HT16K3.P$20(ROW5/K3) U$15.18(F) U$16.18(F) U$17.18(F) U$18.18(F)
N$83: HT16K3.P$19(ROW6/K4) U$15.13(N) U$16.13(N) U$17.13(N) U$18.13(N)
N$84: HT16K3.P$18(ROW7/K5) U$15.6(J) U$16.6(J) U$17.6(J) U$18.6(J)
N$85: D4.C R13.1 R14.1 R15.1
N$87: HT16K3.P$17(ROW8/K6) U$15.17(P) U$16.17(P) U$17.17(P) U$18.17(P)
N$88: HT16K3.P$16(ROW9/K7) U$15.15(G) U$16.15(G) U$17.15(G) U$18.15(G)
N$89: HT16K3.P$15(ROW10/K8) U$15.14(H) U$16.14(H) U$17.14(H) U$18.14(H)
N$90: HT16K3.P$14(ROW11/K9) U$15.2(M) U$16.2(M) U$17.2(M) U$18.2(M)
N$91: HT16K3.P$13(ROW12/K10) U$15.4(L) U$16.4(L) U$17.4(L) U$18.4(L)
N$92: HT16K3.P$12(ROW13/K11) U$15.5(K) U$16.5(K) U$17.5(K) U$18.5(K)
N$93: HT16K3.P$11(ROW14/K12) U$15.8(DP) U$16.8(DP) U$17.8(DP) U$18.8(DP)
N$97: HT16K3.P$5(COM3/KS2) U$16.11(COM2)
N$98: HT16K3.P$4(COM2/KS1) U$16.16(COM1)
N$99: HT16K3.P$6(COM4) U$17.16(COM1)
N$100: HT16K3.P$7(COM5) U$17.11(COM2)
N$102: HT16K3.P$8(COM6) U$18.16(COM1)
N$103: HT16K3.P$9(COM7) U$18.11(COM2)
N$104: HT16K3.P$3(COM1/KS0) U$15.11(COM2)
N$105: HT16K33.P$3(COM1/KS0) U$2.11(COM2)
N$108: HT16K4.P$22(ROW3/K1) U$19.7(D) U$20.7(D) U$21.7(D) U$22.7(D)
N$109: HT16K4.P$21(ROW4/K2) U$19.1(E) U$20.1(E) U$21.1(E) U$22.1(E)
N$110: HT16K4.P$20(ROW5/K3) U$19.18(F) U$20.18(F) U$21.18(F) U$22.18(F)
N$111: HT16K4.P$19(ROW6/K4) U$19.13(N) U$20.13(N) U$21.13(N) U$22.13(N)
N$112: HT16K4.P$18(ROW7/K5) U$19.6(J) U$20.6(J) U$21.6(J) U$22.6(J)
N$113: D5.C R23.1 R24.1 R25.1
N$115: HT16K4.P$17(ROW8/K6) U$19.17(P) U$20.17(P) U$21.17(P) U$22.17(P)
N$116: HT16K4.P$16(ROW9/K7) U$19.15(G) U$20.15(G) U$21.15(G) U$22.15(G)
N$117: HT16K4.P$15(ROW10/K8) U$19.14(H) U$20.14(H) U$21.14(H) U$22.14(H)
N$118: HT16K4.P$14(ROW11/K9) U$19.2(M) U$20.2(M) U$21.2(M) U$22.2(M)
N$119: HT16K4.P$13(ROW12/K10) U$19.4(L) U$20.4(L) U$21.4(L) U$22.4(L)
N$120: HT16K4.P$12(ROW13/K11) U$19.5(K) U$20.5(K) U$21.5(K) U$22.5(K)
N$121: HT16K4.P$11(ROW14/K12) U$19.8(DP) U$20.8(DP) U$21.8(DP) U$22.8(DP)
N$125: HT16K4.P$5(COM3/KS2) U$20.11(COM2)
N$126: HT16K4.P$4(COM2/KS1) U$20.16(COM1)
N$127: HT16K4.P$6(COM4) U$21.16(COM1)
N$128: HT16K4.P$7(COM5) U$21.11(COM2)
N$129: HT16K4.P$8(COM6) U$22.16(COM1)
N$130: HT16K4.P$9(COM7) U$22.11(COM2)
N$131: HT16K4.P$3(COM1/KS0) U$19.11(COM2)
N$134: HT16K5.P$22(ROW3/K1) U$23.7(D) U$24.7(D) U$25.7(D) U$26.7(D)
N$135: HT16K5.P$21(ROW4/K2) U$23.1(E) U$24.1(E) U$25.1(E) U$26.1(E)
N$136: HT16K5.P$20(ROW5/K3) U$23.18(F) U$24.18(F) U$25.18(F) U$26.18(F)
N$137: HT16K5.P$19(ROW6/K4) U$23.13(N) U$24.13(N) U$25.13(N) U$26.13(N)
N$138: HT16K5.P$18(ROW7/K5) U$23.6(J) U$24.6(J) U$25.6(J) U$26.6(J)
N$139: D6.C R28.1 R29.1 R30.1
N$141: HT16K5.P$17(ROW8/K6) U$23.17(P) U$24.17(P) U$25.17(P) U$26.17(P)
N$142: HT16K5.P$16(ROW9/K7) U$23.15(G) U$24.15(G) U$25.15(G) U$26.15(G)
N$143: HT16K5.P$15(ROW10/K8) U$23.14(H) U$24.14(H) U$25.14(H) U$26.14(H)
N$144: HT16K5.P$14(ROW11/K9) U$23.2(M) U$24.2(M) U$25.2(M) U$26.2(M)
N$145: HT16K5.P$13(ROW12/K10) U$23.4(L) U$24.4(L) U$25.4(L) U$26.4(L)
N$146: HT16K5.P$12(ROW13/K11) U$23.5(K) U$24.5(K) U$25.5(K) U$26.5(K)
N$147: HT16K5.P$11(ROW14/K12) U$23.8(DP) U$24.8(DP) U$25.8(DP) U$26.8(DP)
N$151: HT16K5.P$5(COM3/KS2) U$24.11(COM2)
N$152: HT16K5.P$4(COM2/KS1) U$24.16(COM1)
N$153: HT16K5.P$6(COM4) U$25.16(COM1)
N$154: HT16K5.P$7(COM5) U$25.11(COM2)
N$155: HT16K5.P$8(COM6) U$26.16(COM1)
N$156: HT16K5.P$9(COM7) U$26.11(COM2)
N$157: HT16K5.P$3(COM1/KS0) U$23.11(COM2)
N$160: HT16K6.P$22(ROW3/K1) U$27.7(D) U$28.7(D) U$29.7(D) U$30.7(D)
N$161: HT16K6.P$21(ROW4/K2) U$27.1(E) U$28.1(E) U$29.1(E) U$30.1(E)
N$162: HT16K6.P$20(ROW5/K3) U$27.18(F) U$28.18(F) U$29.18(F) U$30.18(F)
N$163: HT16K6.P$19(ROW6/K4) U$27.13(N) U$28.13(N) U$29.13(N) U$30.13(N)
N$164: HT16K6.P$18(ROW7/K5) U$27.6(J) U$28.6(J) U$29.6(J) U$30.6(J)
N$165: D7.C R33.1 R34.1 R35.1
N$167: HT16K6.P$17(ROW8/K6) U$27.17(P) U$28.17(P) U$29.17(P) U$30.17(P)
N$168: HT16K6.P$16(ROW9/K7) U$27.15(G) U$28.15(G) U$29.15(G) U$30.15(G)
N$169: HT16K6.P$15(ROW10/K8) U$27.14(H) U$28.14(H) U$29.14(H) U$30.14(H)
N$170: HT16K6.P$14(ROW11/K9) U$27.2(M) U$28.2(M) U$29.2(M) U$30.2(M)
N$171: HT16K6.P$13(ROW12/K10) U$27.4(L) U$28.4(L) U$29.4(L) U$30.4(L)
N$172: HT16K6.P$12(ROW13/K11) U$27.5(K) U$28.5(K) U$29.5(K) U$30.5(K)
N$173: HT16K6.P$11(ROW14/K12) U$27.8(DP) U$28.8(DP) U$29.8(DP) U$30.8(DP)
N$177: HT16K6.P$5(COM3/KS2) U$28.11(COM2)
N$178: HT16K6.P$4(COM2/KS1) U$28.16(COM1)
N$179: HT16K6.P$6(COM4) U$29.16(COM1)
N$180: HT16K6.P$7(COM5) U$29.11(COM2)
N$181: HT16K6.P$8(COM6) U$30.16(COM1)
N$182: HT16K6.P$9(COM7) U$30.11(COM2)
N$183: HT16K6.P$3(COM1/KS0) U$27.11(COM2)
N$186: HT16K7.P$22(ROW3/K1) U$31.7(D) U$32.7(D) U$33.7(D) U$34.7(D)
N$187: HT16K7.P$21(ROW4/K2) U$31.1(E) U$32.1(E) U$33.1(E) U$34.1(E)
N$188: HT16K7.P$20(ROW5/K3) U$31.18(F) U$32.18(F) U$33.18(F) U$34.18(F)
N$189: HT16K7.P$19(ROW6/K4) U$31.13(N) U$32.13(N) U$33.13(N) U$34.13(N)
N$190: HT16K7.P$18(ROW7/K5) U$31.6(J) U$32.6(J) U$33.6(J) U$34.6(J)
N$191: D8.C R38.1 R39.1 R40.1
N$193: HT16K7.P$17(ROW8/K6) U$31.17(P) U$32.17(P) U$33.17(P) U$34.17(P)
N$194: HT16K7.P$16(ROW9/K7) U$31.15(G) U$32.15(G) U$33.15(G) U$34.15(G)
N$195: HT16K7.P$15(ROW10/K8) U$31.14(H) U$32.14(H) U$33.14(H) U$34.14(H)
N$196: HT16K7.P$14(ROW11/K9) U$31.2(M) U$32.2(M) U$33.2(M) U$34.2(M)
N$197: HT16K7.P$13(ROW12/K10) U$31.4(L) U$32.4(L) U$33.4(L) U$34.4(L)
N$198: HT16K7.P$12(ROW13/K11) U$31.5(K) U$32.5(K) U$33.5(K) U$34.5(K)
N$199: HT16K7.P$11(ROW14/K12) U$31.8(DP) U$32.8(DP) U$33.8(DP) U$34.8(DP)
N$203: HT16K7.P$5(COM3/KS2) U$32.11(COM2)
N$204: HT16K7.P$4(COM2/KS1) U$32.16(COM1)
N$205: HT16K7.P$6(COM4) U$33.16(COM1)
N$206: HT16K7.P$7(COM5) U$33.11(COM2)
N$207: HT16K7.P$8(COM6) U$34.16(COM1)
N$208: HT16K7.P$9(COM7) U$34.11(COM2)
N$209: HT16K7.P$3(COM1/KS0) U$31.11(COM2)
N$212: HT16K8.P$22(ROW3/K1) U$37.7(D) U$38.7(D) U$39.7(D) U$40.7(D)
N$213: HT16K8.P$21(ROW4/K2) U$37.1(E) U$38.1(E) U$39.1(E) U$40.1(E)
N$214: HT16K8.P$20(ROW5/K3) U$37.18(F) U$38.18(F) U$39.18(F) U$40.18(F)
N$215: HT16K8.P$19(ROW6/K4) U$37.13(N) U$38.13(N) U$39.13(N) U$40.13(N)
N$216: HT16K8.P$18(ROW7/K5) U$37.6(J) U$38.6(J) U$39.6(J) U$40.6(J)
N$217: D9.C R43.1 R44.1 R45.1
N$219: HT16K8.P$17(ROW8/K6) U$37.17(P) U$38.17(P) U$39.17(P) U$40.17(P)
N$220: HT16K8.P$16(ROW9/K7) U$37.15(G) U$38.15(G) U$39.15(G) U$40.15(G)
N$221: HT16K8.P$15(ROW10/K8) U$37.14(H) U$38.14(H) U$39.14(H) U$40.14(H)
N$222: HT16K8.P$14(ROW11/K9) U$37.2(M) U$38.2(M) U$39.2(M) U$40.2(M)
N$223: HT16K8.P$13(ROW12/K10) U$37.4(L) U$38.4(L) U$39.4(L) U$40.4(L)
N$224: HT16K8.P$12(ROW13/K11) U$37.5(K) U$38.5(K) U$39.5(K) U$40.5(K)
N$225: HT16K8.P$11(ROW14/K12) U$37.8(DP) U$38.8(DP) U$39.8(DP) U$40.8(DP)
N$229: HT16K8.P$5(COM3/KS2) U$38.11(COM2)
N$230: HT16K8.P$4(COM2/KS1) U$38.16(COM1)
N$231: HT16K8.P$6(COM4) U$39.16(COM1)
N$232: HT16K8.P$7(COM5) U$39.11(COM2)
N$233: HT16K8.P$8(COM6) U$40.16(COM1)
N$234: HT16K8.P$9(COM7) U$40.11(COM2)
N$235: HT16K8.P$3(COM1/KS0) U$37.11(COM2)
SCL: HT16K2.P$26(SCL) HT16K3.P$26(SCL) HT16K4.P$26(SCL) HT16K5.P$26(SCL) HT16K6.P$26(SCL) HT16K7.P$26(SCL) HT16K8.P$26(SCL) HT16K33.P$26(SCL) J1.3 R6.2 R11.2 R16.2 R18.2 R26.2 R31.2 R36.2 R41.2
SDA: HT16K2.P$27(SDA) HT16K3.P$27(SDA) HT16K4.P$27(SDA) HT16K5.P$27(SDA) HT16K6.P$27(SDA) HT16K7.P$27(SDA) HT16K8.P$27(SDA) HT16K33.P$27(SDA) J1.2 R7.2 R12.2 R17.2 R19.2 R27.2 R32.2 R37.2 R42.2
VDD: HT16K2.P$28(VDD) HT16K3.P$28(VDD) HT16K4.P$28(VDD) HT16K5.P$28(VDD) HT16K6.P$28(VDD) HT16K7.P$28(VDD) HT16K8.P$28(VDD) HT16K33.P$28(VDD) J1.1 J2.2 R6.1 R7.1 R11.1 R12.1 R16.1 R17.1 R18.1 R19.1 R26.1 R27.1 R31.1 R32.1 R36.1 R37.1 R41.1 R42.1
Unconnected: HT16K2.P$10(ROW15/K13/INT) HT16K3.P$10(ROW15/K13/INT) HT16K4.P$10(ROW15/K13/INT) HT16K5.P$10(ROW15/K13/INT) HT16K6.P$10(ROW15/K13/INT) HT16K7.P$10(ROW15/K13/INT) HT16K8.P$10(ROW15/K13/INT) HT16K33.P$10(ROW15/K13/INT) R8.2 R10.2 R14.2 R15.2 R20.2 R21.2 R22.2 R25.2 R28.2 R29.2 R33.2 R39.2

## Notes on the sheet
- 0
- 1
- 2
- 3
- 4
- 5
- 6
- 7

## Library data of the parts
D1 D3-D9 = adafruit:DIODE: Diode SMADIODE - SMA Surface Mount Package 20V 1A Schottky Diode Digikey: 641-1014-6-ND DO-1N4148 - Through Hole Small Current Diode SOD-123 20V 1 A (.5mV Vf) Schottky Diode - Digikey: MBRX120TPMSCT-ND SOD-323 10V 570mA (.38mV Vf, 3ns) Schottky Diode - Digikey: ZLLS410CT-ND SOD-523 30V 30mA Schottky Diode (RB751S-40TE61) - Digikey: RB751S-40TE61CT-ND SOT23-R/W - SOT23 Package (R = Solder Paste/Reflow Ovens, W = Hand-Soldering) BAT54Film 40V 300mA - Digikey: 497-7162-1-ND
HT16K2-HT16K8 HT16K33 = microbuilder:HT16K33_SOP28
J1 = SparkFun-Connectors:CONN_04: Multi connection point. Often used as Generic Header-pin footprint for 0.1 inch spaced/style header connections On any of the 0.1 inch spaced packages, you can populate with these: Break Away Headers - Straight <https://www.sparkfun.com/products/116> (PRT-00116) Break Away Male Headers - Right Angle <https://www.sparkfun.com/products/553> (PRT-00553) Female Headers <https://www.sparkfun.com/products/115> (PRT-00115) Break Away Headers - Machine Pin <https://www.sparkfun.com/products/117> (PRT-00117) Break Away Female Headers - Swiss Machine Pin <https://www.sparkfun.com/products/743> (PRT-00743) For SCREWTERMINALS and SPRING TERMINALS visit here: Screw Terimnals on SparkFun.com <https://www.sparkfun.com/search/results?term=Screw+Terminals> (5mm/3.5mm/2.54mm spacing) This device is also useful as a general connection point to wire up your design to another part of your project. Our various solder wires solder well into these plated through hole pads. Hook-Up Wire - Assortment (Stranded, 22 AWG) <https://www.sparkfun.com/products/11375> (PRT-11375) Hook-Up Wire - Assortment (Solid Core, 22 AWG) <https://www.sparkfun.com/products/11367> (PRT-11367) View the entire wire category on our website here <https://www.sparkfun.com/categories/141> Special notes: Molex polarized connector foot print use with SKU : PRT-08231 with associated crimp pins and housings. 1MM SMD Version SKU: PRT-10208; PROD_ID: CONN-13251
J2 = SparkFun-Connectors:CONN_02: Multi connection point. Often used as Generic Header-pin footprint for 0.1 inch spaced/style header connections On any of the 0.1 inch spaced packages, you can populate with these: Break Away Headers - Straight <https://www.sparkfun.com/products/116> (PRT-00116) Break Away Male Headers - Right Angle <https://www.sparkfun.com/products/553> (PRT-00553) Female Headers <https://www.sparkfun.com/products/115> (PRT-00115) Break Away Headers - Machine Pin <https://www.sparkfun.com/products/117> (PRT-00117) Break Away Female Headers - Swiss Machine Pin <https://www.sparkfun.com/products/743> (PRT-00743) For SCREWTERMINALS and SPRING TERMINALS visit here: Screw Terimnals on SparkFun.com <https://www.sparkfun.com/search/results?term=Screw+Terminals> (5mm/3.5mm/2.54mm spacing) This device is also useful as a general connection point to wire up your design to another part of your project. Our various solder wires solder well into these plated through hole pads. Hook-Up Wire - Assortment (Stranded, 22 AWG) <https://www.sparkfun.com/products/11375> (PRT-11375) Hook-Up Wire - Assortment (Solid Core, 22 AWG) <https://www.sparkfun.com/products/11367> (PRT-11367) View the entire wire category on our website here <https://www.sparkfun.com/categories/141> Special notes: Molex polarized connector foot print use with: PRT-08233 with associated crimp pins and housings. 2.54_SCREWTERM for use with PRT-10571. 3.5mm Screw Terminal footprints for PRT-08084 5mm Screw Terminal footprints for use with PRT-08432; PROD_ID: CONN-08399
R6-R45 = microbuilder:RESISTOR: Resistors For new designs, use the packages preceded by an '_' character since they are more reliable: The following footprints should be used on most boards: _0402 - Standard footprint for regular board layouts _0603 - Standard footprint for regular board layouts _0805 - Standard footprint for regular board layouts _1206 - Standard footprint for regular board layouts For extremely tight-pitch boards where space is at a premium, the following 'micro-pitch' footprints can be used (smaller pads, no silkscreen outline, etc.): _0402MP - Micro-pitch footprint for very dense/compact boards _0603MP - Micro-pitch footprint for very dense/compact boards _0805MP - Micro-pitch footprint for very dense/compact boards _1206MP - Micro-pitch footprint for very dense/compact boards
U$2-U$5 U$11-U$34 U$37-U$40 = Segment displays:BIG14SEG
U$35 U$36 U$41 U$42 = Segment displays:KEYSTONESTANDOFF